# Altium project Universal_Analog_Input.PrjPcb (part 1 of 2)
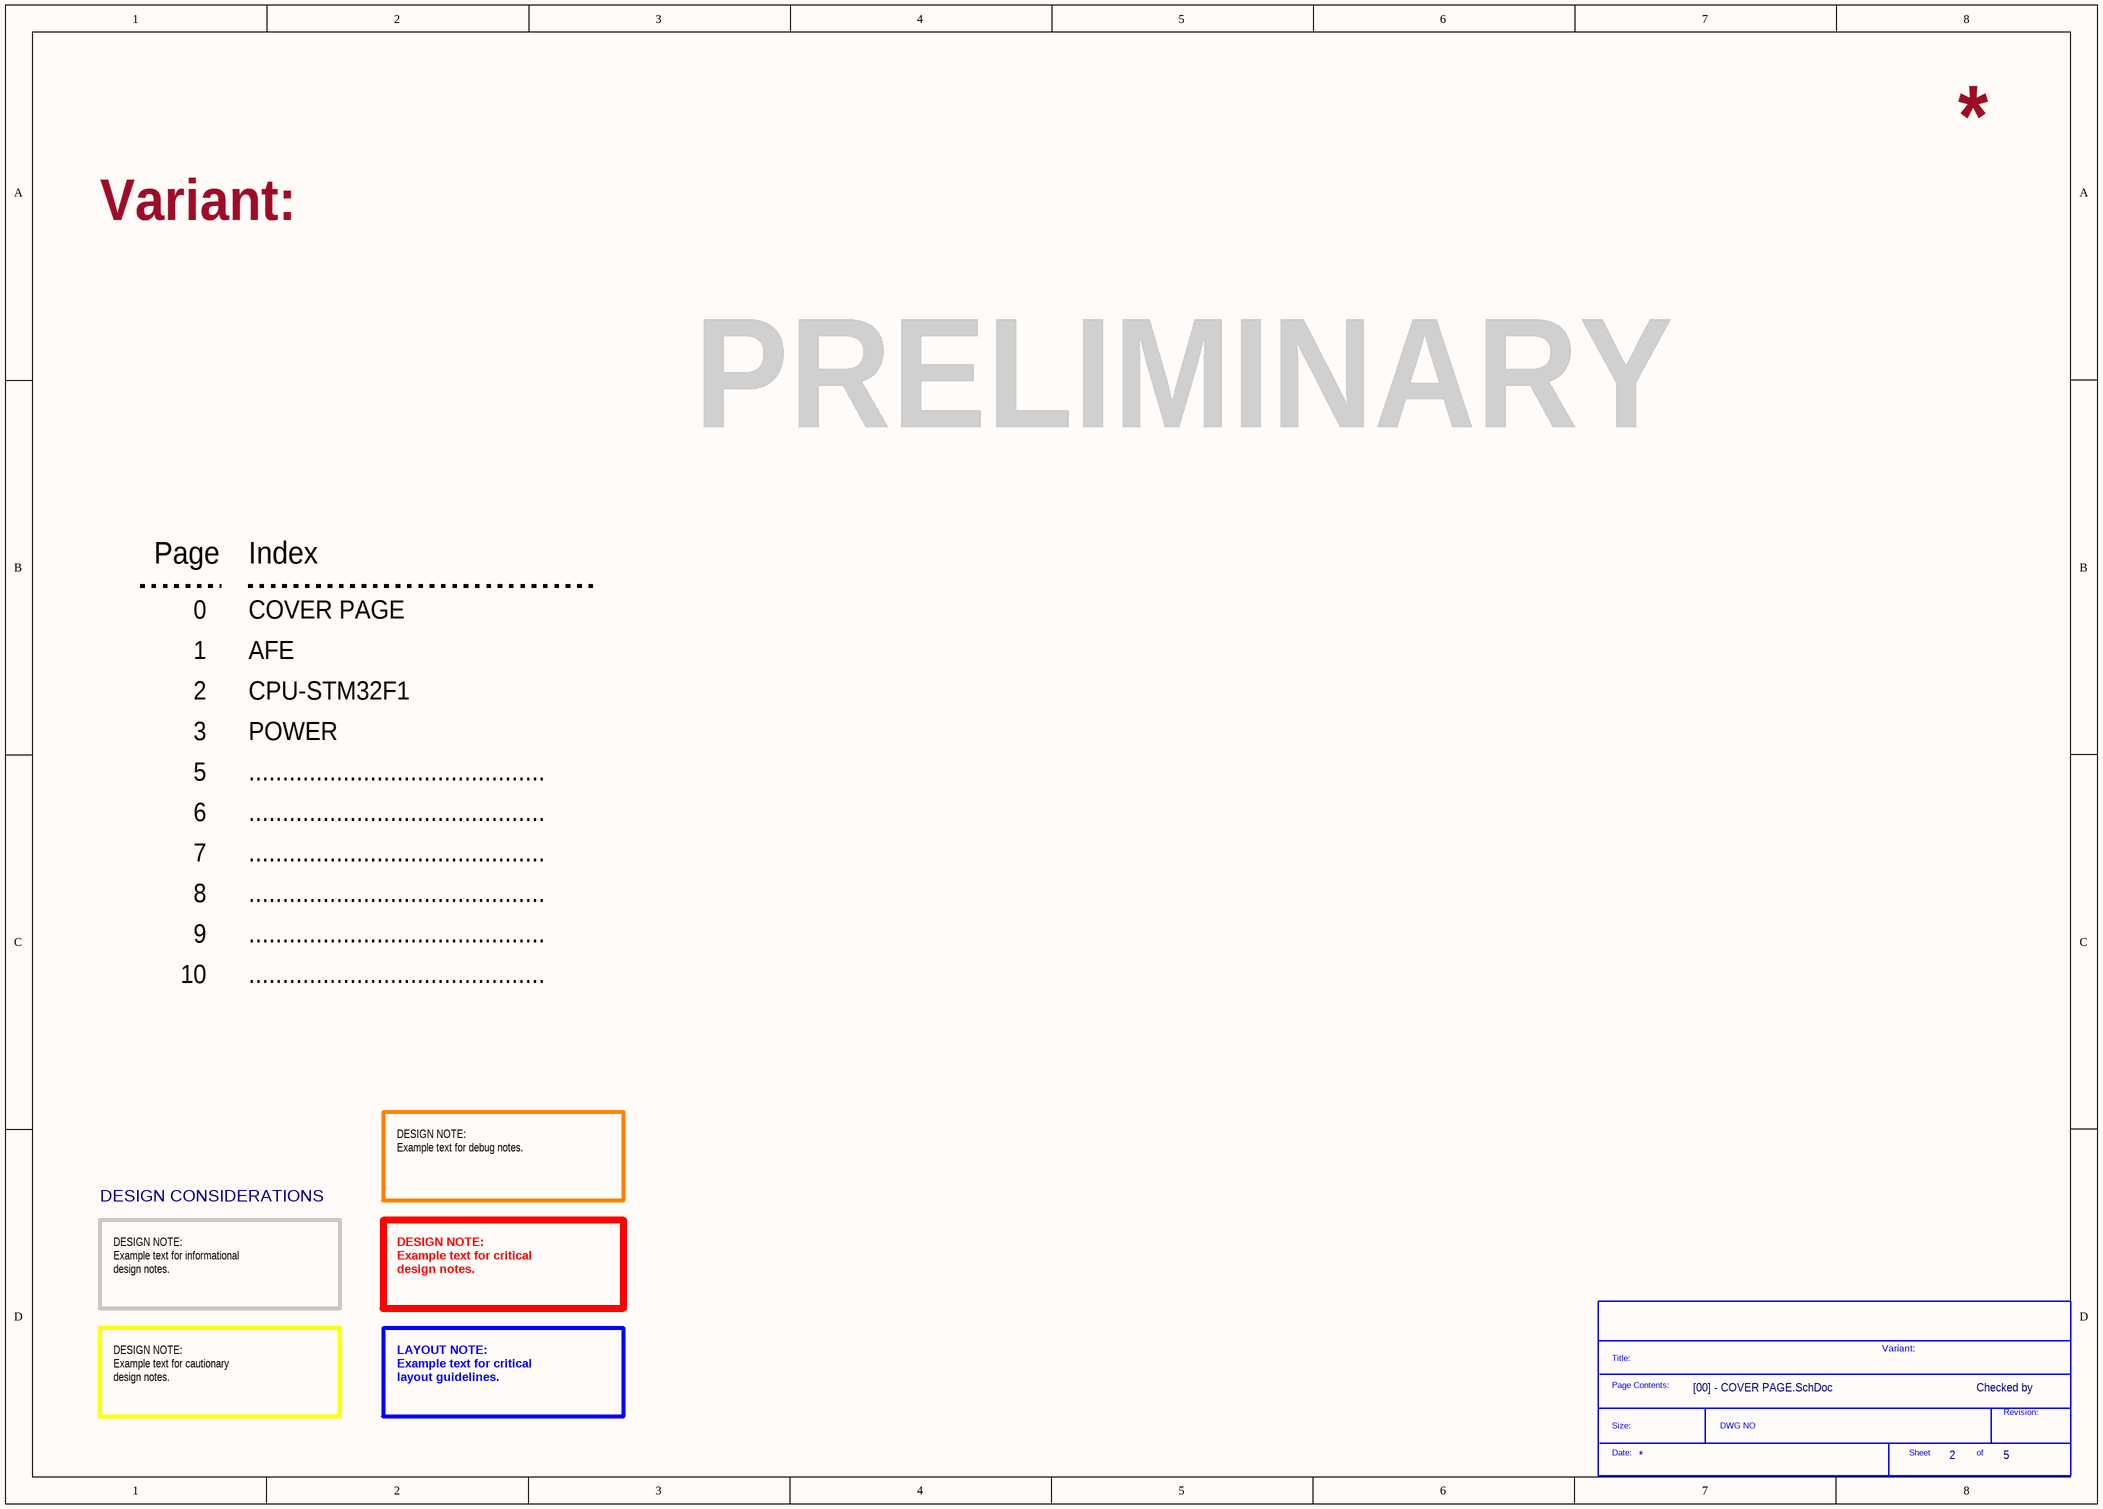
[diagram p0: [00] - COVER PAGE.SchDoc]
4 sheets, 131 parts. Net scope: flat (ports and power ports of the same name join across sheets).
Board file: UAI.PcbDoc
Sheets:
  [00] - COVER PAGE.SchDoc
  [01] - AFE.SchDoc
  [02] - STM32F1.SchDoc
  [03] - Power.SchDoc

## Sheet [00] - COVER PAGE.SchDoc
size A3; DocumentNumber: 2; SheetNumber: 2; SheetTotal: 5

### Parts
*  SDTitleBlock  (value not drawn)  (graphical)

### Notes on the sheet
- Variant:
- PRELIMINARY
- Page
- Index
- 0
- COVER PAGE
- 1
- 2
- AFE
- CPU-STM32F1
- 3
- 5
- POWER
- ............................................
- 6
- 7
- 8
- 9
- 10
- DESIGN NOTE:
  Example text for debug notes.
- DESIGN CONSIDERATIONS
- DESIGN NOTE:
  Example text for informational
  design notes.
- DESIGN NOTE:
  Example text for critical
  design notes.
- Checked by
- DESIGN NOTE:
  Example text for cautionary
  design notes.
- LAYOUT NOTE:
  Example text for critical
  layout guidelines.
- (in symbol SDTitleBlock) Title:; Page Contents:; Revision:; Size:; DWG NO; Date:; Sheet; of

## Sheet [01] - AFE.SchDoc: Universal Analog Input
size A1; CompanyName: Envest Enerji ve Su Verimliliği LTD ŞTİ; DocumentNumber: 3; SheetNumber: 3; SheetTotal: 5
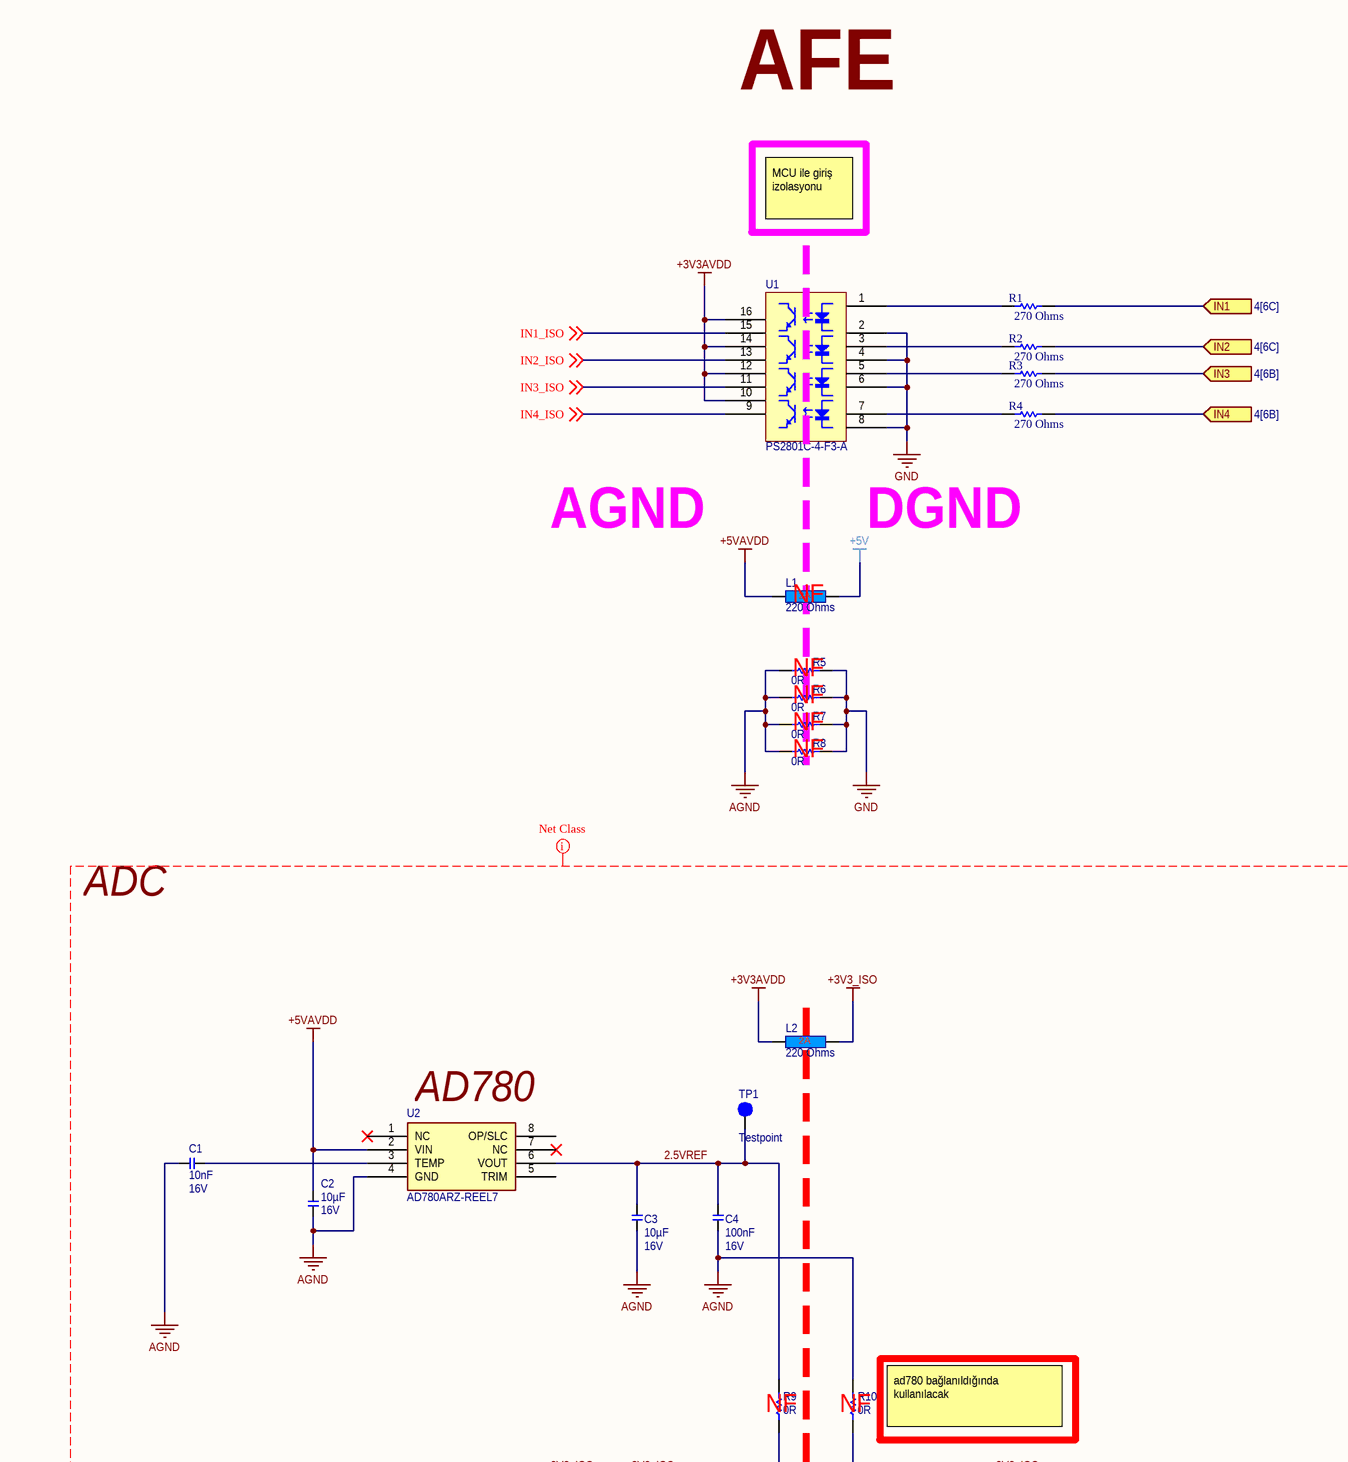
[diagram p1: [01] - AFE.SchDoc, top middle]
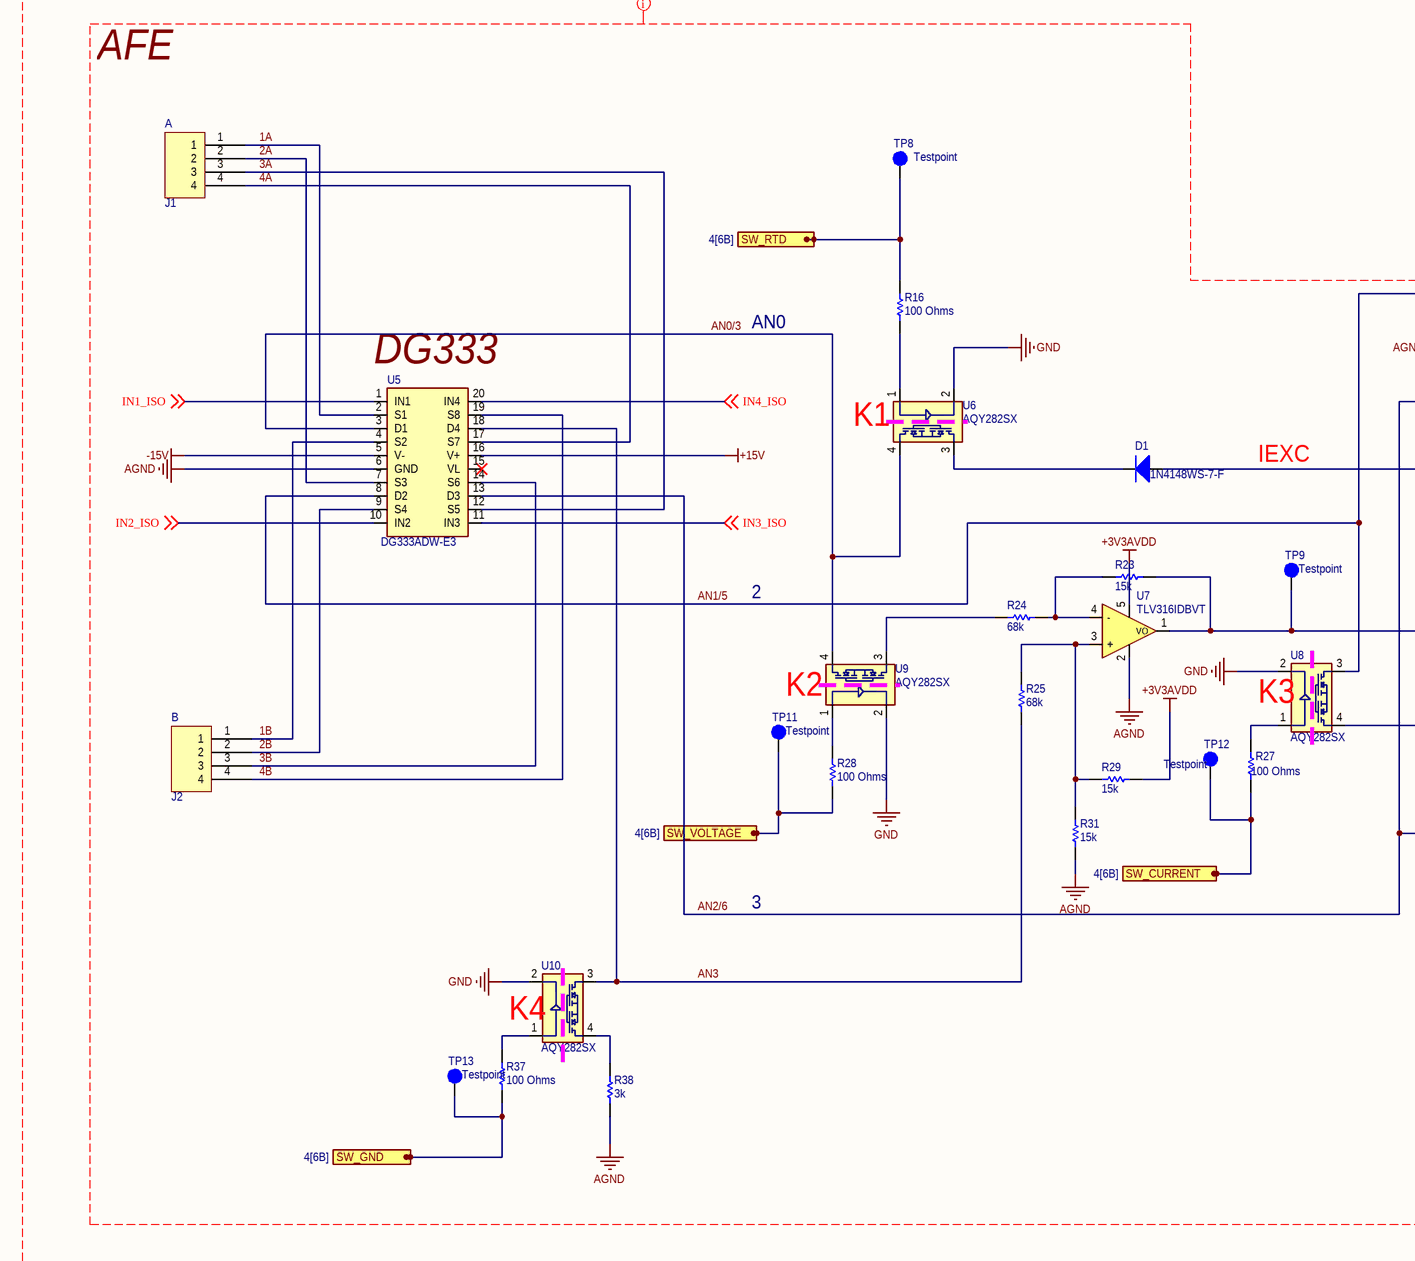
[diagram p2: [01] - AFE.SchDoc, bottom left]
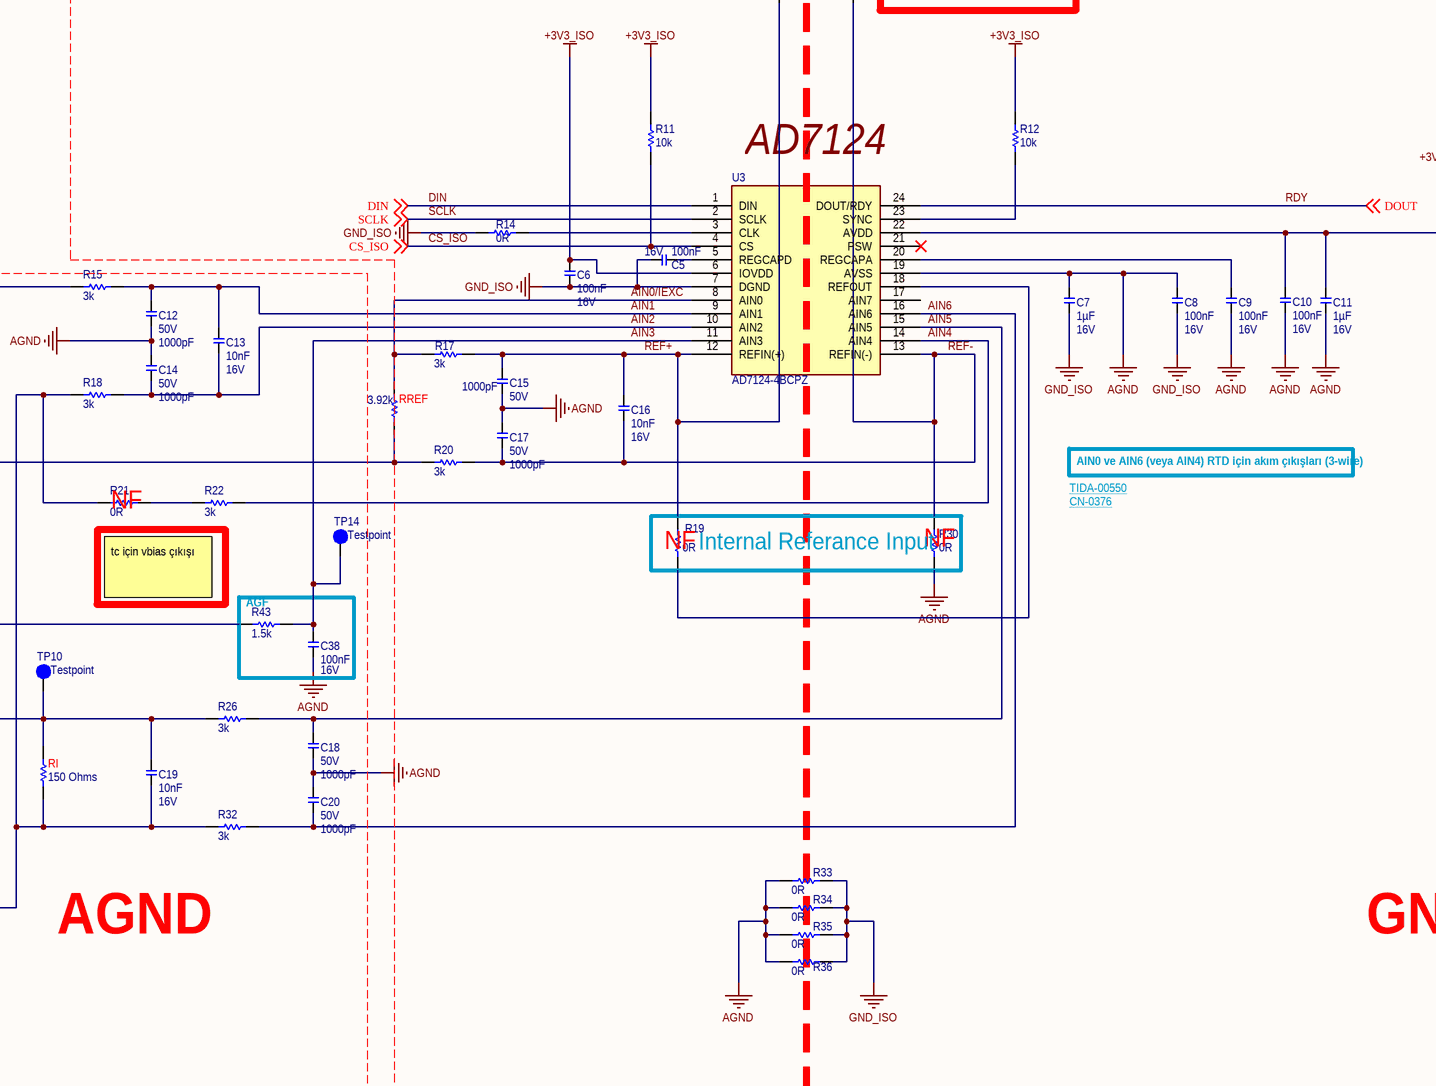
[diagram p3: [01] - AFE.SchDoc, bottom middle]
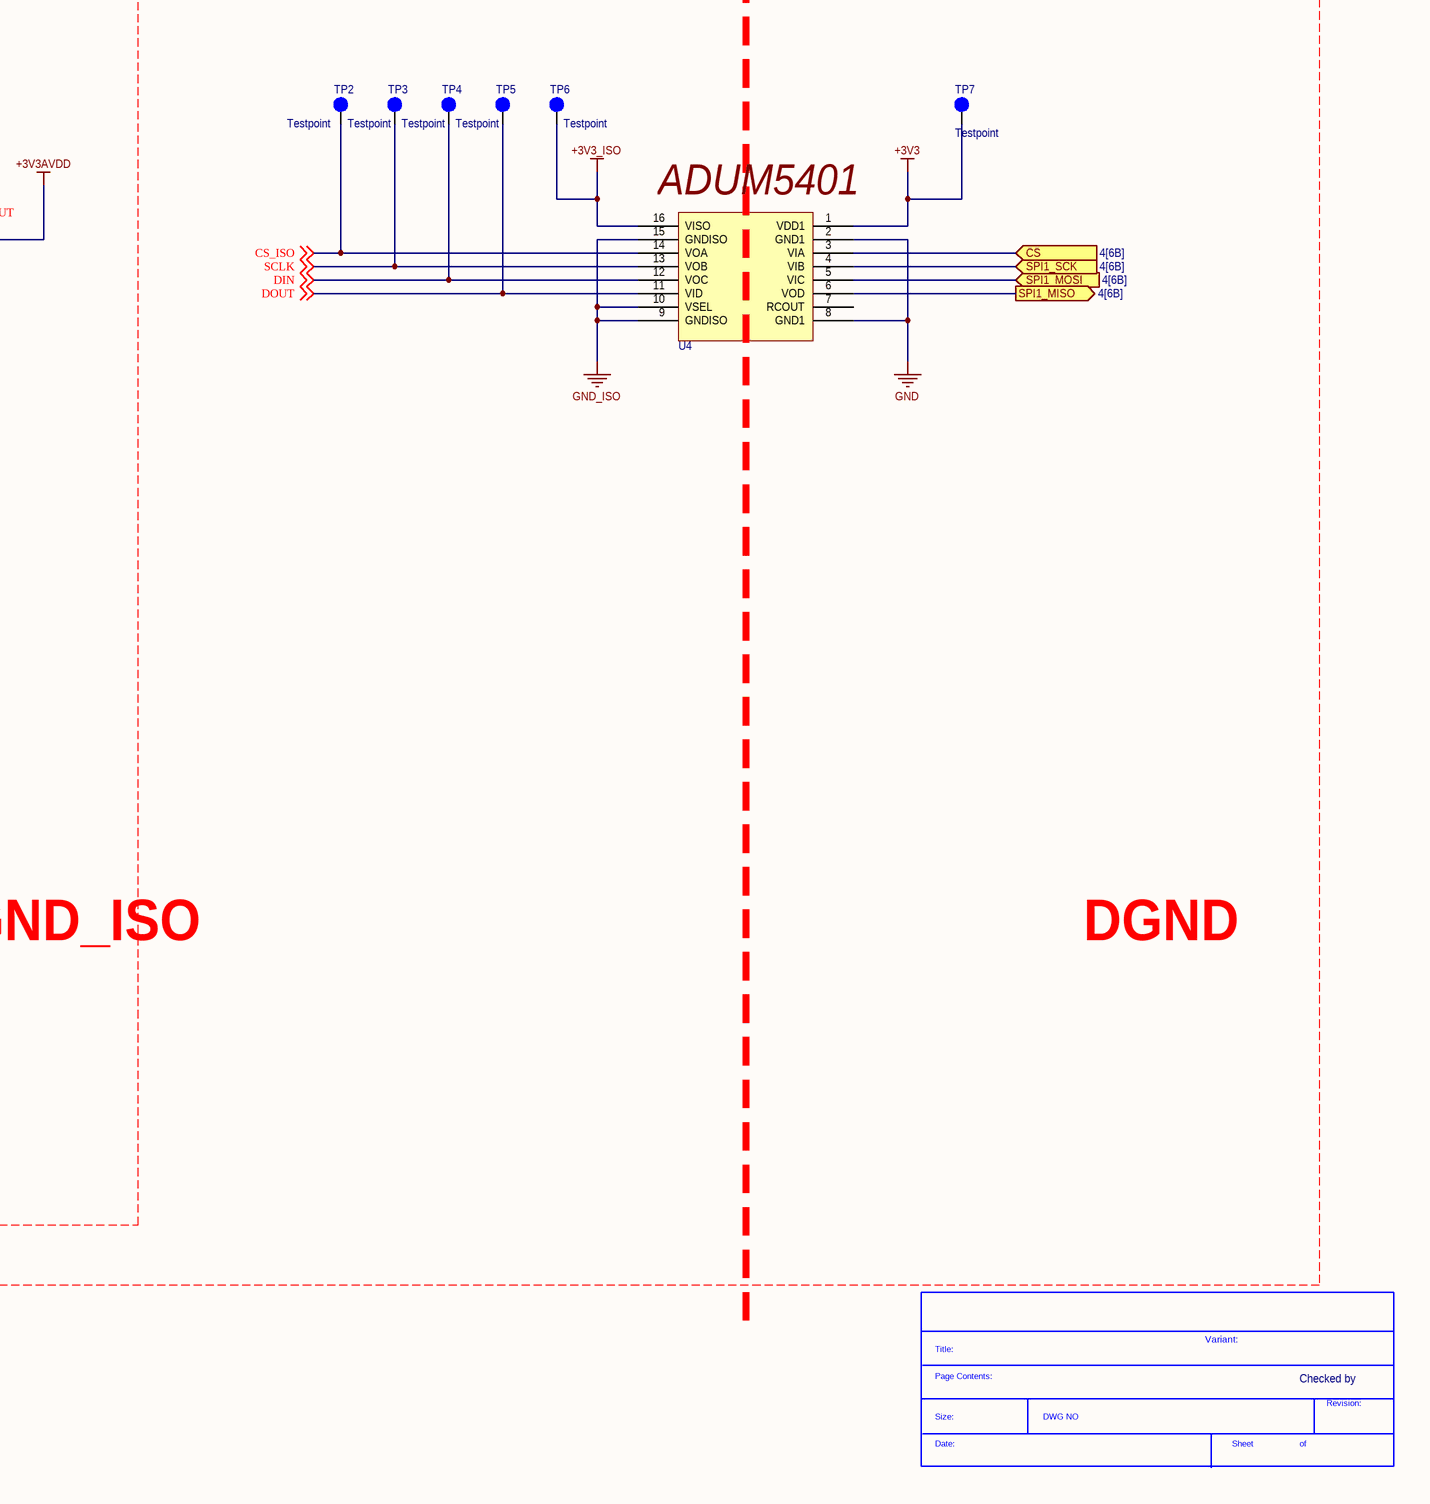
[diagram p4: [01] - AFE.SchDoc, bottom right]

### Parts
(Parts that share a designator on the sheet are numbered #1, #2 ... from top to bottom, then left to right.)
*?#1  SDTitleBlock  (value not drawn)  (graphical)
C1  Voltage - Rated: 16V  [C0805]  (hidden comment: 10nF)
C2  Voltage - Rated: 16V  [C0805]  (hidden comment: 10µF)
C3  Voltage - Rated: 16V  [C0805]  (hidden comment: 10µF)
C4  Voltage - Rated: 16V  [C0805]  (hidden comment: 100nF)
C5  Voltage - Rated: 16V  [C0805]  (hidden comment: 100nF)
C6  Voltage - Rated: 16V  [C0805]  (hidden comment: 100nF)
C7  Voltage - Rated: 16V  [C0805]  (hidden comment: 1µF)
C8  Voltage - Rated: 16V  [C0805]  (hidden comment: 100nF)
C9  Voltage - Rated: 16V  [C0805]  (hidden comment: 100nF)
C10  Voltage - Rated: 16V  [C0805]  (hidden comment: 100nF)
C11  Voltage - Rated: 16V  [C0805]  (hidden comment: 1µF)
C12  Voltage - Rated: 50V  Capacitance: 1000pF  [C0805]  (hidden comment: C0805C102K5RAC7411)
C13  Voltage - Rated: 16V  [C0805]  (hidden comment: 10nF)
C14  Voltage - Rated: 50V  Capacitance: 1000pF  [C0805]  (hidden comment: C0805C102K5RAC7411)
C15  Voltage - Rated: 50V  Capacitance: 1000pF  [C0805]  (hidden comment: C0805C102K5RAC7411)
C16  Voltage - Rated: 16V  [C0805]  (hidden comment: 10nF)
C17  Voltage - Rated: 50V  Capacitance: 1000pF  [C0805]  (hidden comment: C0805C102K5RAC7411)
C18  Voltage - Rated: 50V  Capacitance: 1000pF  [C0805]  (hidden comment: C0805C102K5RAC7411)
C19  Voltage - Rated: 16V  [C0805]  (hidden comment: 10nF)
C20  Voltage - Rated: 50V  Capacitance: 1000pF  [C0805]  (hidden comment: C0805C102K5RAC7411)
C38  Voltage - Rated: 16V  [C0805]  (hidden comment: 100nF)
D1  Manufacturer Part Number: 1N4148WS-7-F  [SOD-323]  (hidden comment: D-1N4148WS)
J1  CON-4 PIN  [CONECTOR_PCB_4_90]  (value not drawn)
J2  CON-4 PIN  [CONECTOR_PCB_4_90]  (value not drawn)
L1  Impedance: 220 Ohms  [0805]  (hidden comment: FERRITE CHIP 220 OHM 0805)
L2  Impedance: 220 Ohms  [0805]  (hidden comment: FERRITE CHIP 220 OHM 0805)
R1  Resistance: 270 Ohms  [R0805]  (hidden comment: 270R)
R2  Resistance: 270 Ohms  [R0805]  (hidden comment: 270R)
R3  Resistance: 270 Ohms  [R0805]  (hidden comment: 270R)
R4  Resistance: 270 Ohms  [R0805]  (hidden comment: 270R)
R5  0R  [R0805]
R6  0R  [R0805]
R7  0R  [R0805]
R8  0R  [R0805]
R9  0R  [R0805]
R10  0R  [R0805]
R11  Resistance (Ohms): 10k  [R0805]  (hidden comment: R-10K,%1,0805)
R12  Resistance (Ohms): 10k  [R0805]  (hidden comment: R-10K,%1,0805)
R14  0R  [R0805]
R15  Resistance (Ohms): 3k  [R0805]  (hidden comment: CPF-A-0805B3K0E)
R16  100 Ohms  [R0805]
R17  Resistance (Ohms): 3k  [R0805]  (hidden comment: CPF-A-0805B3K0E)
R18  Resistance (Ohms): 3k  [R0805]  (hidden comment: CPF-A-0805B3K0E)
R19  0R  [R0805]
R20  Resistance (Ohms): 3k  [R0805]  (hidden comment: CPF-A-0805B3K0E)
R21  0R  [R0805]
R22  Resistance (Ohms): 3k  [R0805]  (hidden comment: CPF-A-0805B3K0E)
R23  Resistance (Ohms): 15k  [R0805]  (hidden comment: 15K OHM)
R24  Resistance (Ohms): 68k  [R0805]  (hidden comment: RES SMD 68K OHM)
R25  Resistance (Ohms): 68k  [R0805]  (hidden comment: RES SMD 68K OHM)
R26  Resistance (Ohms): 3k  [R0805]  (hidden comment: CPF-A-0805B3K0E)
R27  100 Ohms  [R0805]
R28  100 Ohms  [R0805]
R29  Resistance (Ohms): 15k  [R0805]  (hidden comment: 15K OHM)
R30  0R  [R0805]
R31  Resistance (Ohms): 15k  [R0805]  (hidden comment: 15K OHM)
R32  Resistance (Ohms): 3k  [R0805]  (hidden comment: CPF-A-0805B3K0E)
R33  0R  [R0805]
R34  0R  [R0805]
R35  0R  [R0805]
R36  0R  [R0805]
R37  100 Ohms  [R0805]
R38  Resistance (Ohms): 3k  [R0805]  (hidden comment: CPF-A-0805B3K0E)
R43  1.5k  [R0805]
RI  150 Ohms  [R0805]
RREF  Resistance (Ohms): 3.92k  [R0805]  (hidden comment: RN73C2A3K92BTD)
TP1  Testpoint  [tp_smd1mmcircle]  (no BOM)
TP2  Testpoint  [tp_smd1mmcircle]  (no BOM)
TP3  Testpoint  [tp_smd1mmcircle]  (no BOM)
TP4  Testpoint  [tp_smd1mmcircle]  (no BOM)
TP5  Testpoint  [tp_smd1mmcircle]  (no BOM)
TP6  Testpoint  [tp_smd1mmcircle]  (no BOM)
TP7  Testpoint  [tp_smd1mmcircle]  (no BOM)
TP8  Testpoint  [tp_smd1mmcircle]  (no BOM)
TP9  Testpoint  [tp_smd1mmcircle]  (no BOM)
TP10  Testpoint  [tp_smd1mmcircle]  (no BOM)
TP11  Testpoint  [tp_smd1mmcircle]  (no BOM)
TP12  Testpoint  [tp_smd1mmcircle]  (no BOM)
TP13  Testpoint  [tp_smd1mmcircle]  (no BOM)
TP14  Testpoint  [tp_smd1mmcircle]  (no BOM)
U1  PS2801C-4-F3-A  [U_16_D LONG]
U2  Manufacturer Part Number: AD780ARZ-REEL7  [SOIC-8]  (hidden comment: AD780ARZ)
U3  AD7124-4BCPZ  [TSSOP-24]
U4  ADUM5401ARWZ-RL  [DW16_L]  (value not drawn)
U5  Manufacturer Part Number: DG333ADW-E3  [SOIC-20W]  (hidden comment: Analog Switch)
U6  AQY282SX  [CPC1017N]
U7  TLV316IDBVT  [SOT23-5]
U8  AQY282SX  [CPC1017N]
U9  AQY282SX  [CPC1017N]
U10  AQY282SX  [CPC1017N]

### Blocks framed on the sheet
AGF: C38 R43

### Ports
CS (in, see 4[6B]), IN1 (in, see 4[6C]), IN2 (in, see 4[6C]), IN3 (in, see 4[6B]), IN4 (in, see 4[6B]), SPI1_MISO (out, see 4[6B]), SPI1_MOSI (in, see 4[6B]), SPI1_SCK (in, see 4[6B]), SW_CURRENT (in, see 4[6B]), SW_GND (in, see 4[6B]), SW_RTD (in, see 4[6B]), SW_VOLTAGE (in, see 4[6B])

### Nets
+3V3: TP7.1 U4.1(VDD1)
+3V3_ISO: C6.2 L2.2 R11.2 R12.2 TP6.1 U3.6(IOVDD) U4.16(VISO)
+3V3AVDD: C10.2 C11.2 L2.1 R29.2 U1.10 U1.12 U1.14 U1.16 U3.22(AVDD) U7.5(VDD)
+5V: L1.2
+5VAVDD: C2.2 L1.1 U2.2(VIN)
+15V: U5.16(V+)
-15V: U5.5(V-)
AGND: C1.1 C2.1 C3.1 C4.2 C7.2 C8.2 C9.1 C10.1 C11.1 C12.1 C14.2 C15.1 C17.2 C18.1 C20.2 C38.1 R5.1 R6.1 R7.1 R8.1 R10.2 R30.1 R31.1 R33.1 R34.1 R35.1 R36.1 R38.1 U2.4(GND) U3.19(AVSS) U5.6(GND) U7.2(VSS)
GND: R5.2 R6.2 R7.2 R8.2 U1.2 U1.4 U1.6 U1.8 U4.2(GND1) U4.8(GND1) U6.2 U8.2 U9.2 U10.2
GND_ISO: C5.2 C6.1 C7.1 C8.1 R14.1 R33.2 R34.2 R35.2 R36.2 U3.7(DGND) U4.9(GNDISO) U4.10(VSEL) U4.15(GNDISO)
1A: J1.1 U5.2(S1)
1B: J2.1 U5.4(S2)
2.5VREF: C3.2 C4.1 R9.2 TP1.1 U2.6(VOUT)
2A: J1.2 U5.7(S3)
2B: J2.2 U5.9(S4)
3A: J1.3 U5.12(S5)
3B: J2.3 U5.14(S6)
4A: J1.4 U5.17(S7)
4B: J2.4 U5.19(S8)
AIN0/IEXC: R17.1 RREF.2 U3.8(AIN0)
AIN1: C12.2 C13.2 R15.2 U3.9(AIN1)
AIN2: C13.1 C14.1 R18.2 U3.10(AIN2)
AIN3: C38.2 R43.2 TP14.1 U3.11(AIN3)
AIN4: R22.2 U3.14(AIN4)
AIN5: C18.2 R26.2 U3.15(AIN5)
AIN6: C20.1 R32.2 U3.16(AIN6)
AN0/3: U5.3(D1) U6.4 U9.4
AN1/5: R15.1 U5.8(D2) U8.3
AN2/6: C19.1 R18.1 R21.1 R32.1 RI.2 U5.13(D3)
AN3: R25.1 U5.18(D4) U10.3
CS_ISO: R11.1 TP2.1 U3.4(CS) U4.14(VOA) ; off-sheet CS_ISO
DIN: TP4.1 U3.1(DIN) U4.12(VOC) ; off-sheet DIN
IEXC: D1.2 R20.1 RREF.1
IN1_ISO: U1.15 U5.1(IN1) ; off-sheet IN1_ISO
IN2_ISO: U1.13 U5.10(IN2) ; off-sheet IN2_ISO
IN3_ISO: U1.11 U5.11(IN3) ; off-sheet IN3_ISO
IN4_ISO: U1.9 U5.20(IN4) ; off-sheet IN4_ISO
RDY: TP5.1 U3.24(DOUT/RDY) U4.11(VID) ; off-sheet DOUT  [also labelled DOUT]
REF+: C15.2 C16.2 R9.1 R17.2 R19.2 U3.12(REFIN(+))
REF-: C16.1 C17.1 R10.1 R20.2 R30.2 U3.13(REFIN(-))
SCLK: TP3.1 U3.2(SCLK) U4.13(VOB) ; off-sheet SCLK
SPI1_MISO: U4.6(VOD) ; port SPI1_MISO
SPI1_MOSI: U4.5(VIC) ; port SPI1_MOSI
SPI1_SCK: U4.4(VIB) ; port SPI1_SCK
NetC1_2: C1.2 U2.3(TEMP)
NetC5_1: C5.1 U3.5(REGCAPD)
NetC9_2: C9.2 U3.20(REGCAPA)
NetC19_2: C19.2 R26.1 RI.1 TP10.1 U8.4
NetD1_1: D1.1 U6.3
NetR1_1: R1.1 U1.1
NetR1_2: R1.2 ; port IN1
NetR2_1: R2.1 U1.3
NetR2_2: R2.2 ; port IN2
NetR3_1: R3.1 U1.5
NetR3_2: R3.2 ; port IN3
NetR4_1: R4.1 U1.7
NetR4_2: R4.2 ; port IN4
NetR12_1: R12.1 U3.23(SYNC)
NetR14_2: R14.2 U3.3(CLK)
NetR16_1: R16.1 TP8.1 ; port SW_RTD
NetR16_2: R16.2 U6.1
NetR19_1: R19.1 U3.18(REFOUT)
NetR21_2: R21.2 R22.1
NetR23_1: R23.1 R24.2 U7.4(-)
NetR23_2: R23.2 R43.1 TP9.1 U7.1(VO)
NetR24_1: R24.1 U9.3
NetR25_2: R25.2 R29.1 R31.2 U7.3(+)
NetR27_1: R27.1 TP12.1 ; port SW_CURRENT
NetR27_2: R27.2 U8.1
NetR28_1: R28.1 TP11.1 ; port SW_VOLTAGE
NetR28_2: R28.2 U9.1
NetR37_1: R37.1 TP13.1 ; port SW_GND
NetR37_2: R37.2 U10.1
NetR38_2: R38.2 U10.4
NetU4_3: U4.3(VIA) ; port CS

Not connected (* = marked no-connect by the designer): U2 1(NC)* 5(TRIM) 7(NC)* 8(OP/SLC); U3 17(AIN7) 21(PSW)*; U4 7(RCOUT); U5 15(VL)*

### Layout directives
net class ADC: 2.5VREF, +3V3_ISO, +3V3AVDD, +5VAVDD, AGND, AIN0/IEXC, AIN1, AIN2, AIN3, AIN4, AIN5, AIN6, CS_ISO, DIN, DOUT, GND_ISO, RDY, REF+, REF-, SCLK
net class AFE: 1A, 1B, 2A, 2B, 3A, 3B, 4A, 4B, +3V3AVDD, +15V, -15V, AGND, AN0/3, AN1/5, AN2/6, AN3, GND, IEXC, IN1_ISO, IN2_ISO, IN3_ISO, IN4_ISO
net class ANALOG: 1A, 1B, 2.5VREF, 2A, 2B, 3A, 3B, 4A, 4B, +3V3, +3V3_ISO, +3V3AVDD, +5V, +5VAVDD, +15V, -15V, AGND, AIN0/IEXC, AIN1, AIN2, AIN3, AIN4, AIN5, AIN6, AN0/3, AN1/5, AN2/6, AN3, CS_ISO, DIN, DOUT, GND, GND_ISO, IEXC, IN1_ISO, IN2_ISO, IN3_ISO, IN4_ISO, RDY, REF+, REF-, SCLK

### Notes on the sheet
- AFE
- MCU ile giriş izolasyonu
- AGND
- DGND
- (near L1) NF
- (near R5) NF
- (near R6) NF
- (near R7) NF
- (near R8) NF
- ADC
- (near U2) AD780
- (near R9) NF
- (near R10) NF
- (near R10) ad780 bağlanıldığında kullanılacak
- (near J1) A
- (near U3) AD7124
- (near U4) ADUM5401
- (near U5) DG333
- AN0
- (near U6) K1
- (near R21) NF
- CN-0376 <http://www.analog.com/media/en/reference-design-documentation/reference-designs/CN0376.pdf>
- TIDA-00550 <http://www.ti.com/lit/ug/tidubi1/tidubi1.pdf>
- AIN0 ve AIN6 (veya AIN4) RTD için akım çıkışları (3-wire)
- (near R19) NF
- (near R30) Internal Referance Input
- (near R30) NF
- 2
- tc için vbias çıkışı
- (near J2) B
- (near U9) K2
- (near U8) K3
- 3
- GND_ISO
- (near U10) K4
- Variant:
- Checked by
- (in symbol L-220 Ohm,2A) 2A
- (in symbol SDTitleBlock) Title:; Page Contents:; Revision:; Size:; DWG NO; Date:; Sheet; of

### Library data of the parts
C1 = C-10NF,0805: CAP CER 10000PF 16V NP0 0805; Manufacturer: AVX Corporation; Manufacturer Part Number: 0805YA103JAT2A; Tolerance: ±5%; Temperature Coefficient: C0G, NP0; Supplier 1: Digi-Key; RoHS: RoHS Compliant; Category: Capacitors; Stock 1: 28062; Pricing 1: 1=0.29, 10=0.204, 25=0.1668, 50=0.1424, 100=0.1221, 250=0.10176, 500=0.09158, 1000=0.07733 (USD); Packaging: Cut Tape (CT); Mounting Type: Surface Mount, MLCC; Operating Temperature: -55°C ~ 125°C; Applications: General Purpose; Ratings: -; Package / Case: 0805 (2012 Metric); Size / Dimension: 0.079" L x 0.049" W (2.01mm x 1.25mm); Height - Seated (Max): -; Thickness (Max): 0.037" (0.94mm); Lead Spacing: -; Features: -; Lead Style: -; ComponentLink1URL: http://datasheets.avx.com/C0GNP0-Dielectric.pdf; ComponentLink1Description: http://datasheets.avx.com/C0GNP0-Dielectric.pdf; Supplier Part Number 1: 478-1334-1-ND; Capacitance: 10nF
C2 C3 = C-10UF,16V,0805: AVX - 0805YD106KAT2A - CAP, MLCC, X5R, 10UF, 16V, 0805; Manufacturer: AVX Corporation; Tolerance: ±10%; Supplier 1: Digi-Key; Manufacturer Part Number: 0805YD106KAT2A; RoHS: RoHS Compliant; Category: Capacitors; Stock 1: 293738; Pricing 1: 1=0.18, 10=0.124, 25=0.0908, 50=0.0742, 100=0.0627, 250=0.05116, 500=0.0429, 1000=0.03795 (USD); Packaging: Digi-Reel®; Temperature Coefficient: X5R; Mounting Type: Surface Mount, MLCC; Operating Temperature: -55°C ~ 85°C; Applications: General Purpose; Ratings: -; Package / Case: 0805 (2012 Metric); Size / Dimension: 0.079" L x 0.049" W (2.01mm x 1.25mm); Height - Seated (Max): -; Thickness (Max): 0.055" (1.40mm); Lead Spacing: -; Features: -; Lead Style: -; ComponentLink1URL: http://datasheets.avx.com/cx5r.pdf; ComponentLink1Description: http://datasheets.avx.com/cx5r.pdf; Supplier Part Number 1: 478-5165-6-ND; Capacitance: 10µF
C4-C6 C8-C10 C38 = C-100NF,16V,0805: AVX - 0805YA103JAT2A - CAP, MLCC, C0G/NP0, 10NF, 16V, 0805; Tolerance: ±5%; Temperature Coefficient: C0G, NP0; Manufacturer: AVX; Manufacturer Part Number: 0805YA103JAT2A; RoHS: YES; ComponentLink1URL: http://www.avx.com/docs/Catalogs/ccog.pdf; ComponentLink1Description: http://www.avx.com/docs/Catalogs/ccog.pdf; ComponentLink2URL: http://www.farnell.com/datasheets/1825494.pdf; ComponentLink2Description: http://www.farnell.com/datasheets/1825494.pdf; Supplier 1: Digi-Key; Category: Capacitors; Stock 1: 28062; Pricing 1: 1=0.29, 10=0.204, 25=0.1668, 50=0.1424, 100=0.1221, 250=0.10176, 500=0.09158, 1000=0.07733 (USD); Packaging: Cut Tape (CT); Mounting Type: Surface Mount, MLCC; Operating Temperature: -55°C ~ 125°C; Applications: General Purpose; Ratings: -; Package / Case: 0805 (2012 Metric); Size / Dimension: 0.079" L x 0.049" W (2.01mm x 1.25mm); Height - Seated (Max): -; Thickness (Max): 0.037" (0.94mm); Lead Spacing: -; Features: -; Lead Style: -; ComponentLink3URL: http://datasheets.avx.com/C0GNP0-Dielectric.pdf; ComponentLink3Description: http://datasheets.avx.com/C0GNP0-Dielectric.pdf; Supplier Part Number 1: 478-1334-1-ND; Capacitance: 100nF
C7 C11 = C-1UF,16V,0805: AVX - 0805YC105KAT2A - CAP, MLCC, X7R, 1UF, 16V, 0805; Manufacturer: AVX Corporation; Tolerance: ±10%; Supplier 1: Digi-Key; Manufacturer Part Number: 0805YC105KAT2A; RoHS: RoHS Compliant; Category: Capacitors; Stock 1: 76930; Pricing 1: 1=0.19, 10=0.132, 25=0.0964, 50=0.075, 100=0.0622, 250=0.05148, 500=0.04362, 1000=0.03611 (USD); Packaging: Cut Tape (CT); Temperature Coefficient: X7R; Mounting Type: Surface Mount, MLCC; Operating Temperature: -55°C ~ 125°C; Applications: General Purpose; Ratings: -; Package / Case: 0805 (2012 Metric); Size / Dimension: 0.079" L x 0.049" W (2.01mm x 1.25mm); Height - Seated (Max): -; Thickness (Max): 0.055" (1.40mm); Lead Spacing: -; Features: -; Lead Style: -; ComponentLink1URL: http://datasheets.avx.com/X7RDielectric.pdf; ComponentLink1Description: http://datasheets.avx.com/X7RDielectric.pdf; Supplier Part Number 1: 478-5034-1-ND; Capacitance: 1µF
C12 C14 C15 C17 C18 C20 = C-1nF,50V,0805: CAP CER 1000PF 50V X7R 0805; Manufacturer: Kemet; Tolerance: ±10%; Supplier 1: Digi-Key; Manufacturer Part Number: C0805C102K5RAC7411; RoHS: RoHS Compliant; Category: Capacitors; Stock 1: 60000; Pricing 1: 15000=0.0062, 30000=0.00589, 75000=0.00527, 105000=0.00426 (USD); Packaging: Tape & Reel (TR); Temperature Coefficient: X7R; Mounting Type: Surface Mount, MLCC; Operating Temperature: -55°C ~ 125°C; Applications: General Purpose; Ratings: -; Package / Case: 0805 (2012 Metric); Size / Dimension: 0.079" L x 0.049" W (2.00mm x 1.25mm); Height - Seated (Max): -; Thickness (Max): 0.035" (0.88mm); Lead Spacing: -; Features: Low ESL; Lead Style: -; ComponentLink1URL: http://www.kemet.com/docfinder?Partnumber=C0805C102K5RAC7411; ComponentLink1Description: http://www.kemet.com/docfinder?Partnumber=C0805C102K5RAC7411; Supplier Part Number 1: 399-7361-2-ND
C13 C16 C19 = C-10NF,16V,0805: CAP CER 10000PF 16V NP0 0805; Manufacturer: AVX Corporation; Manufacturer Part Number: 0805YA103JAT2A; Tolerance: ±5%; Temperature Coefficient: C0G, NP0; Supplier 1: Digi-Key; RoHS: RoHS Compliant; Category: Capacitors; Stock 1: 28062; Pricing 1: 1=0.29, 10=0.204, 25=0.1668, 50=0.1424, 100=0.1221, 250=0.10176, 500=0.09158, 1000=0.07733 (USD); Packaging: Cut Tape (CT); Mounting Type: Surface Mount, MLCC; Operating Temperature: -55°C ~ 125°C; Applications: General Purpose; Ratings: -; Package / Case: 0805 (2012 Metric); Size / Dimension: 0.079" L x 0.049" W (2.01mm x 1.25mm); Height - Seated (Max): -; Thickness (Max): 0.037" (0.94mm); Lead Spacing: -; Features: -; Lead Style: -; ComponentLink1URL: http://datasheets.avx.com/C0GNP0-Dielectric.pdf; ComponentLink1Description: http://datasheets.avx.com/C0GNP0-Dielectric.pdf; Supplier Part Number 1: 478-1334-1-ND; Capacitance: 10nF
D1 = D-1N4148WS: DIODES INC. - 1N4148WS-7-F - DIODE, SS SWITCH, 75V, 0.2W, SOD323; Diode Configuration: Single; Repetitive Reverse Voltage Vrrm Max: 75; Forward Current If(AV): 150; Forward Voltage VF Max: 1.25; Reverse Recovery Time trr Max: 4; Forward Surge Current Ifsm Max: 2; Product Range: 1N4148 Series; SVHC: No SVHC (17-Dec-2015); Diode Type: Switching; Supplier 1: Farnell; Manufacturer: DIODES INC.; RoHS: YES; Stock 1: 52116; Pricing 1: 1=0.186, 25=0.142, 100=0.0928, 250=0.0514, 500=0.0433, 1000=0.0256, 3000=0.025, 8000=0.0239 (GBP); Operating Temperature Max: 150; Diode Case Style: SOD-323; No. of Pins: 2; Packaging: Cut Tape; MSL: MSL 1 - Unlimited; Operating Temperature Min: -65; Operating Temperature Range: -65°C to +150°C<!--FANDB--><div class="features-and-benefits-container"><div class="features-and-benefits-description"><span class="features-benefits-value">The 1N4148WS-7-F is a surface mount fast Switching Diode with matte tin-plated terminals and an UL94V-0 green molding compound molded plastic case. Solderable terminals as per MIL-STD-202, method 208 standard. Color band denotes cathode end polarity. It is suitable for general purpose switching applications.</span></div><div class="features-and-benefits-list"><ul class="features-and-benefits-list-list"><li class="features-and-benefits-list-item">Fast switching speed</li><li class="features-and-benefits-list-item">100V Non-repetitive peak reverse voltage</li><li class="features-and-benefits-list-item">53V RMS reverse voltage</li><li class="features-and-benefits-list-item">200mW Power dissipation</li><li class="features-and-benefits-list-item">625; ComponentLink1URL: http://www.farnell.com/datasheets/1911818.pdf; ComponentLink1Description: http://www.farnell.com/datasheets/1911818.pdf; Supplier Part Number 1: 1843678
J1 J2 = CON-4 PIN: Terminal Block 4 Pin
L1 L2 = L-220 Ohm,2A: Manufacturer: Murata; Manufacturer Part Number: BLM21PG221SN1D; Tolerance: 25; Resistance: 50; Max Current Rating: 2; Supplier 1: Digikey; Stock 1: 423629; Pricing 1: 1=0.11, 10=0.09, 50=0.0732, 100=0.0537, 250=0.0391, 500=0.0358, 1000=0.0309 (USD); Mount: Surface Mount; Case/Package: 0805; Case Code (Metric): 2012; Case Code (Imperial): 0805; Min Operating Temperature: -55; Max Operating Temperature: 125; Core Material: Ferrite; Package Quantity: 1; Packaging: Tape and Reel; Current Rating: 2; Length: 2; Height: 0.85; Width: 1.25; Radiation Hardening: No; REACH SVHC: No SVHC; Supplier Part Number 1: 490-1054-1-ND
R1-R4 = R-270R,0805: TE CONNECTIVITY / NEOHM 270R Thin Film; Manufacturer Part Number: CPF0805B270RE1; Product Range: TE CONNECTIVITY - CPF Series; Power Rating: 100; Resistance Tolerance: ± 0.1%; Resistor Case Style: 0805 [2012 Metric]; Temperature Coefficient: ± 25; Voltage Rating: 200; External Depth: 0.5; External Length / Height: 2; External Width: 1.25; Resistor Mounting: SMD; Supplier 1: Farnell; Manufacturer: TE CONNECTIVITY / NEOHM; RoHS: YES; Stock 1: 755; Pricing 1: 10=0,43, 50=0,34, 100=0,32, 500=0,27, 1000=0,24 (EUR); Resistor Element Material: Thin Film; Packaging: Cut Tape; MSL: -; No. of Pins: 2; Operating Temperature Max: 155; Operating Temperature Min: -55; Operating Temperature Range: -55°C to +155; Series: CPF<!--FANDB--><div class="features-and-benefits-container"></div>; ComponentLink1URL: http://www.tycoelectronics.com/commerce/DocumentDelivery/DDEController?Action=srchrtrv&DocNm=1614884&DocType=Customer+Drawing&DocLang=English; ComponentLink1Description: http://www.tycoelectronics.com/commerce/DocumentDelivery/DDEController?Action=srchrtrv&DocNm=1614884&DocType=Customer+Drawing&DocLang=English; ComponentLink2URL: http://www.tycoelectronics.com/commerce/DocumentDelivery/DDEController?Action=srchrtrv&DocNm=1773200&DocType=Data+Sheet&DocLang=English; ComponentLink2Description: http://www.tycoelectronics.com/commerce/DocumentDelivery/DDEController?Action=srchrtrv&DocNm=1773200&DocType=Data+Sheet&DocLang=English; Supplier Part Number 1: 1697424
R5-R10 R14 R19 R21 R30 R33-R36 = R-0R,0805: BOURNS - CR0805-J/-000ELF - RESISTOR, 0805, 0R, 5%, 1/8W; Product Range: BOURNS - CR Series; Power Rating: 125; Resistor Case Style: 0805 [2012 Metric]; Resistor Element Material: Thick Film; Temperature Coefficient: -250ppm/°C to +500; Voltage Rating: 150; SVHC: No SVHC (16-Jun-2014); Resistor Mounting: SMD<!--FANDB--><div class="features-and-benefits-container"></div>; Supplier 1: Farnell; Manufacturer: BOURNS; Manufacturer Part Number: CR0805-J/-000ELF; RoHS: YES; Stock 1: 20931; Pricing 1: 50=0,0234, 250=0,0208, 1000=0,0182, 5000=0,0143, 10000=0,0104 (EUR); Resistance Tolerance: ± 5%; Packaging: Cut Tape; MSL: MSL 1 - Unlimited; ComponentLink1URL: http://www.farnell.com/datasheets/1845293.pdf; ComponentLink1Description: http://www.farnell.com/datasheets/1845293.pdf; Supplier Part Number 1: 2008388RL; Supplier 2: Farnell; Supplier 3: Newark; Supplier Part Number 3: 66F5622; Resistance: 0R
R11 R12 = R-10K,%1,0805: RES SMD 10K OHM 1% 1/8W 0805; Manufacturer: Yageo; Manufacturer Part Number: RC0805FR-0710KL; Power (Watts): 0.125W, 1/8W; Temperature Coefficient: ±100ppm/°C; Supplier 1: Digi-Key; RoHS: RoHS Compliant; Category: Resistors; Stock 1: 4020575; Pricing 1: 1=0.1, 10=0.021, 25=0.0152, 100=0.0084, 250=0.00644, 500=0.00514, 1000=0.00379, 2500=0.00329 (USD); Packaging: Cut Tape (CT); Tolerance: ±1%; Composition: Thick Film; Features: Moisture Resistant; Operating Temperature: -55°C ~ 155°C; Package / Case: 0805 (2012 Metric); Supplier Device Package: 0805; Size / Dimension: 0.079" L x 0.049" W (2.00mm x 1.25mm); Height: 0.024" (0.60mm); Number of Terminations: 2; ComponentLink1URL: http://www.yageo.com/documents/recent/PYu-RC_Group_51_RoHS_L_04.pdf; ComponentLink1Description: http://www.yageo.com/documents/recent/PYu-RC_Group_51_RoHS_L_04.pdf; Supplier Part Number 1: 311-10.0KCRCT-ND
R15 R17 R18 R20 R22 R26 R32 R38 = R-3K,0805: RES SMD 3K OHM 0.1% 1/10W 0805; Manufacturer: TE Connectivity AMP Connectors; Power (Watts): 0.1W, 1/10W; Temperature Coefficient: ±25ppm/°C; Supplier 1: Digi-Key; Manufacturer Part Number: CPF-A-0805B3K0E; RoHS: RoHS Compliant; Category: Resistors; Stock 1: 5000; Pricing 1: 5000=0.09556, 10000=0.09161, 25000=0.08981, 50000=0.08895, 125000=0.08802 (USD); Packaging: Tape & Reel (TR); Tolerance: ±0.1%; Composition: Thin Film; Features: Automotive AEC-Q200; Operating Temperature: -55°C ~ 155°C; Package / Case: 0805 (2012 Metric); Supplier Device Package: 0805; Size / Dimension: 0.079" L x 0.049" W (2.00mm x 1.25mm); Height: 0.026" (0.65mm); Number of Terminations: 2; ComponentLink1URL: http://www.te.com/commerce/DocumentDelivery/DDEController?Action=srchrtrv&DocNm=1773200-1&DocType=DS&DocLang=English; ComponentLink1Description: http://www.te.com/commerce/DocumentDelivery/DDEController?Action=srchrtrv&DocNm=1773200-1&DocType=DS&DocLang=English; Supplier Part Number 1: A124098TR-ND
R16 R27 R28 R37 = R-100R,0805: RES 100 OHM 1/8W 1% 0805 SMD; Manufacturer: Rohm Semiconductor; Manufacturer Part Number: MCR10ERTF1000; Power (Watts): 0.125W, 1/8W; Temperature Coefficient: ±100ppm/°C; Supplier 1: Digi-Key; RoHS: RoHS Compliant; Category: Resistors; Stock 1: 27803; Pricing 1: 1=0.1, 10=0.027, 25=0.0196, 100=0.0109, 250=0.00832, 500=0.00666, 1000=0.0049 (USD); Packaging: Cut Tape (CT); Tolerance: ±1%; Composition: Thick Film; Features: -; Package / Case: 0805 (2012 Metric); Supplier Device Package: 0805 (2012 Metric); Size / Dimension: 0.079" L x 0.049" W (2.00mm x 1.25mm); Height: 0.024" (0.60mm); Number of Terminations: 2; ComponentLink1URL: http://rohmfs.rohm.com/en/products/databook/datasheet/passive/resistor/chip_resistor/mcr_g.pdf; ComponentLink1Description: http://rohmfs.rohm.com/en/products/databook/datasheet/passive/resistor/chip_resistor/mcr_g.pdf; Supplier Part Number 1: RHM100CHCT-ND; Resistance (Ohms): 100 Ohms
R23 R29 R31 = R-15k,0805: RES SMD 15K OHM 5% 1/8W 0805; Manufacturer: Yageo; Manufacturer Part Number: RC0805JR-0715KL; Power (Watts): 0.125W, 1/8W; Temperature Coefficient: ±100ppm/°C; Supplier 1: Digi-Key; RoHS: RoHS Compliant; Category: Resistors; Stock 1: 97321; Pricing 1: 1=0.1, 10=0.018, 25=0.0128, 100=0.0073, 250=0.00556, 500=0.00444, 1000=0.00326, 2500=0.00283 (USD); Packaging: Cut Tape (CT); Tolerance: ±5%; Composition: Thick Film; Features: Moisture Resistant; Operating Temperature: -55°C ~ 155°C; Package / Case: 0805 (2012 Metric); Supplier Device Package: 0805; Size / Dimension: 0.079" L x 0.049" W (2.00mm x 1.25mm); Height: 0.024" (0.60mm); Number of Terminations: 2; ComponentLink1URL: http://www.yageo.com/documents/recent/PYu-RC_Group_51_RoHS_L_04.pdf; ComponentLink1Description: http://www.yageo.com/documents/recent/PYu-RC_Group_51_RoHS_L_04.pdf; Supplier Part Number 1: 311-15KARCT-ND
R24 R25 = R-68k,0805: RES SMD 68K OHM 1% 1/8W 0805; Manufacturer: Samsung Electro-Mechanics America, Inc.; Manufacturer Part Number: RC2012F683CS; Power (Watts): 0.125W, 1/8W; Temperature Coefficient: ±100ppm/°C; Supplier 1: Digi-Key; RoHS: RoHS Compliant; Category: Resistors; Stock 1: 80000; Pricing 1: 5000=0.00473, 10000=0.00411, 25000=0.00361, 50000=0.00339 (USD); Packaging: Tape & Reel (TR); Part Status: Active; Tolerance: ±1%; Composition: Thick Film; Features: Moisture Resistant; Operating Temperature: -55°C ~ 155°C; Package / Case: 0805 (2012 Metric); Supplier Device Package: 0805; Size / Dimension: 0.079" L x 0.049" W (2.00mm x 1.25mm); Height - Seated (Max): 0.026" (0.65mm); Number of Terminations: 2; Failure Rate: -; ComponentLink1URL: http://media.digikey.com/pdf/Data%20Sheets/Samsung%20PDFs/RC_Series_ds.pdf; ComponentLink1Description: http://media.digikey.com/pdf/Data%20Sheets/Samsung%20PDFs/RC_Series_ds.pdf; Supplier Part Number 1: 1276-5386-2-ND
R43 = R-1.5K,%1,0805: RES SMD 1.5K OHM 1% 1/8W 0805; Manufacturer: Yageo; Manufacturer Part Number: RC0805FR-071K5L; Power (Watts): 0.125W, 1/8W; Temperature Coefficient: ±100ppm/°C; Supplier 1: Digi-Key; RoHS: RoHS Compliant; Category: Resistors; Stock 1: 815764; Pricing 1: 1=0.1, 10=0.021, 25=0.0152, 100=0.0084, 250=0.00644, 500=0.00514, 1000=0.00379, 2500=0.00329 (USD); Packaging: Digi-Reel®; Tolerance: ±1%; Composition: Thick Film; Features: Moisture Resistant; Operating Temperature: -55°C ~ 155°C; Package / Case: 0805 (2012 Metric); Supplier Device Package: 0805; Size / Dimension: 0.079" L x 0.049" W (2.00mm x 1.25mm); Height: 0.024" (0.60mm); Number of Terminations: 2; ComponentLink1URL: http://www.yageo.com/documents/recent/PYu-RC_Group_51_RoHS_L_04.pdf; ComponentLink1Description: http://www.yageo.com/documents/recent/PYu-RC_Group_51_RoHS_L_04.pdf; Supplier Part Number 1: 311-1.50KCRDKR-ND; Supplier 2: Digi-Key; Stock 2: 28544; Pricing 2: 1=0.1, 10=0.054, 25=0.0392, 50=0.03, 100=0.0221, 250=0.01684, 500=0.01346, 1000=0.00991, 2500=0.0086 (USD); Part Status: Active; Failure Rate: -; ComponentLink2URL: http://www.vishay.com/docs/20035/dcrcwe3.pdf; ComponentLink2Description: http://www.vishay.com/docs/20035/dcrcwe3.pdf; Resistance (Ohms): 1.5k
RI = R-150R,0805: TE CONNECTIVITY / NEOHM - CPF0805B150RE1 - RESISTOR, 0805, 150R; Product Range: TE CONNECTIVITY - CPF Series; Power Rating: 100; Resistance Tolerance: ± 0.1%; Resistor Case Style: 0805 [2012 Metric]; Resistor Element Material: Thin Film; Temperature Coefficient: ± 25; Voltage Rating: 200; External Depth: 0.5; External Length / Height: 2; External Width: 1.25; Resistor Mounting: SMD; Supplier 1: Farnell; Manufacturer: TE CONNECTIVITY / NEOHM; Manufacturer Part Number: CPF0805B150RE1; RoHS: YES; Stock 1: 749; Pricing 1: 10=0,429, 50=0,338, 100=0,324, 500=0,269, 1000=0,235 (EUR); Packaging: Cut Tape; MSL: -; No. of Pins: 2; Operating Temperature Max: 155; Operating Temperature Min: -55; Operating Temperature Range: -55°C to +155; Series: CPF<!--FANDB--><div class="features-and-benefits-container"></div>; ComponentLink1URL: http://www.tycoelectronics.com/commerce/DocumentDelivery/DDEController?Action=srchrtrv&DocNm=1614884&DocType=Customer+Drawing&DocLang=English; ComponentLink1Description: http://www.tycoelectronics.com/commerce/DocumentDelivery/DDEController?Action=srchrtrv&DocNm=1614884&DocType=Customer+Drawing&DocLang=English; ComponentLink2URL: http://www.tycoelectronics.com/commerce/DocumentDelivery/DDEController?Action=srchrtrv&DocNm=1773200&DocType=Data+Sheet&DocLang=English; ComponentLink2Description: http://www.tycoelectronics.com/commerce/DocumentDelivery/DDEController?Action=srchrtrv&DocNm=1773200&DocType=Data+Sheet&DocLang=English; Supplier Part Number 1: 1697421RL; Resistance: 150 Ohms
RREF = R-3.92K,%1,0805: RES SMD 3.92KOHM 0.1% 1/10W 0805; Manufacturer: TE Connectivity AMP Connectors; Power (Watts): 0.1W, 1/10W; Temperature Coefficient: ±10ppm/°C; Supplier 1: Digi-Key; Manufacturer Part Number: RN73C2A3K92BTD; RoHS: RoHS Compliant; Category: Resistors; Stock 1: 8776; Pricing 1: 1=0.74, 10=0.621, 25=0.532, 50=0.4788, 100=0.4168, 250=0.37248, 500=0.30152, 1000=0.24388, 2500=0.2359 (USD); Packaging: Cut Tape (CT); Part Status: Active; Tolerance: ±0.1%; Composition: Thin Film; Features: -; Operating Temperature: -55°C ~ 155°C; Package / Case: 0805 (2012 Metric); Supplier Device Package: 0805; Size / Dimension: 0.079" L x 0.049" W (2.00mm x 1.25mm); Height: 0.026" (0.65mm); Number of Terminations: 2; ComponentLink1URL: http://media.digikey.com/pdf/Data%20Sheets/Tyco%20Electonics%20AMP%20PDFs/RN73_Series_2011.pdf; ComponentLink1Description: http://media.digikey.com/pdf/Data%20Sheets/Tyco%20Electonics%20AMP%20PDFs/RN73_Series_2011.pdf; Supplier Part Number 1: A119990CT-ND
TP1-TP14 = Testpoint_SMD1mmCircle: Testpoint SMD; PartName: TestpointSMD1mmCircle; TIIntPartnumber: 2H0046; DescriptiveText: Testpoint SMD 1mm circle pad; Cost100: 0; Mfr: N/A; MfrNum: N/A; Vendor: N/A; Cost10K: 0; Descriptive_Text: Testpoint SMD 1mm circle pad
U1 = PS2801C-4-F3-A: NEC - PS2801C-4-F3-A - OPTOCOUPLER, 4X TR O/P, SSOP-16; Supplier 1: Farnell; Supplier Part Number 1: 1682862
U2 = IC-AD780ARZ: IC VREF SERIES/SHUNT PROG 8SOIC; Manufacturer: Analog Devices Inc.; Reference Type: Series, Shunt; Output Type: Programmable; Voltage - Output (Min/Fixed): ±2.5V, ±3V; Current - Output: 10mA; Tolerance: ±0.2%, ±0.17%; Temperature Coefficient: 7ppm/°C; Noise - 0.1Hz to 10Hz: 4µVp-p; Voltage - Input: 4 V ~ 36 V; Current - Supply: 1mA; Supplier 1: Digi-Key; RoHS: RoHS Compliant; Category: Integrated Circuits (ICs); Stock 1: 1014; Pricing 1: 1=10.53, 10=9.545, 100=7.8685, 500=6.8796 (USD); Packaging: Cut Tape (CT); Voltage - Output (Max): -; Noise - 10Hz to 10kHz: -; Current - Cathode: 1mA; Operating Temperature: -40°C ~ 85°C (TA); Mounting Type: Surface Mount; Package / Case: 8-SOIC (0.154", 3.90mm Width); Supplier Device Package: 8-SOIC; ComponentLink1URL: http://www.analog.com/media/en/technical-documentation/data-sheets/AD780.pdf; ComponentLink1Description: http://www.analog.com/media/en/technical-documentation/data-sheets/AD780.pdf; Supplier Part Number 1: AD780ARZ-REEL7CT-ND
U3 = IC-AD7124-4BCPZ: IC ADC 24BIT 4CH TSSOP; Manufacturer: Analog Devices Inc.; Number of Bits: 24; Sampling Rate (Per Second): 19.2k; Number of Inputs: 4, 7; Input Type: Differential, Single Ended; Data Interface: SPI; Configuration: MUX-PGA-ADC; Number of A/D Converters: 1; Architecture: Sigma-Delta; Reference Type: External, Internal; Voltage - Supply, Analog: ±1.8V, 2.7 V ~ 3.6 V; Voltage - Supply, Digital: 1.65 V ~ 3.6 V; Supplier 1: Digi-Key; RoHS: RoHS Compliant; Category: Integrated Circuits (ICs); Stock 1: 46; Pricing 1: 1=10.3, 10=9.307, 100=7.7056, 500=6.70996, 1000=5.84415, 2500=5.6277, 5000=5.41125 (USD); Packaging: Tray; Part Status: Active; Ratio - S/H:ADC: -; Features: PGA, Temperature Sensor; Operating Temperature: -40°C ~ 105°C; Package / Case: 32-WFQFN Exposed Pad, CSP; Supplier Device Package: 32-LFCSP-WQ (5x5); ComponentLink1URL: http://www.analog.com/media/en/technical-documentation/data-sheets/AD7124-4.pdf; ComponentLink1Description: http://www.analog.com/media/en/technical-documentation/data-sheets/AD7124-4.pdf; Supplier 2: Digi-Key; Stock 2: 146; Pricing 2: 1=10.3, 62=8.87452, 124=7.70565, 558=6.70995, 1054=5.84415, 2542=5.6277, 5000=5.41125 (USD); Supplier Part Number 2: AD7124-4BRUZ-ND; Manufacturer Part Number: AD7124-4BCPZ
U4 = IC-ADUM5401: DGTL ISO 2.5KV GEN PURP 16SOIC; Manufacturer: Analog Devices Inc.; Isolated Power: Yes; Number of Channels: 4; Inputs - Side 1/Side 2: 3/1; Channel Type: Unidirectional; Voltage - Isolation: 2500Vrms; Common Mode Transient Immunity (Min): 25kV/µs; Data Rate: 1Mbps; Propagation Delay tpLH / tpHL (Max): 100ns, 100ns; Pulse Width Distortion (Max): 40ns; Rise / Fall Time (Typ): 2.5ns, 2.5ns; Voltage - Supply: 3 V ~ 5.5 V; Supplier 1: Digi-Key; Manufacturer Part Number: ADUM5401ARWZ-RL; RoHS: RoHS Compliant; Category: Isolators; Stock 1: 2137; Pricing 1: 1=10.71, 10=9.818, 100=8.2883, 500=7.35092 (USD); Packaging: Cut Tape (CT); Part Status: Active; Technology: Magnetic Coupling; Type: General Purpose; Operating Temperature: -40°C ~ 105°C; Package / Case: 16-SOIC (0.295", 7.50mm Width); Supplier Device Package: 16-SOIC; ComponentLink1URL: http://www.analog.com/media/en/technical-documentation/data-sheets/ADuM5401_5402_5403_5404.pdf; ComponentLink1Description: http://www.analog.com/media/en/technical-documentation/data-sheets/ADuM5401_5402_5403_5404.pdf; Supplier Part Number 1: ADUM5401ARWZ-RLCT-ND
U5 = IC-DG333ADW-E3: IC SWITCH QUAD SPDT 20SOIC; Manufacturer: Vishay Siliconix; Multiplexer/Demultiplexer Circuit: 2:1; Number of Circuits: 1; On-State Resistance (Max): 45 Ohm; Channel-to-Channel Matching (&Delta;Ron): 2 Ohm (Max); Voltage - Supply, Single (V+): 5 V ~ 40 V; Voltage - Supply, Dual (V±): ±4 V ~ 22 V; Switch Time (Ton, Toff) (Max): 175ns, 145ns; Charge Injection: 10pC; Channel Capacitance (CS(off), CD(off)): 8pF; Current - Leakage (IS(off)) (Max): 250pA; Crosstalk: -80dB @ 1MHz; Supplier 1: Digi-Key; RoHS: RoHS Compliant; Category: Integrated Circuits (ICs); Stock 1: 509; Pricing 1: 1=4.77, 10=4.284, 25=4.05, 100=3.51, 250=3.33, 500=2.988, 1000=2.52, 2500=2.394, 5000=2.304 (USD); Packaging: Tube; Part Status: Active; Switch Circuit: SPDT; -3db Bandwidth: -; Operating Temperature: -40°C ~ 85°C (TA); Package / Case: 20-SOIC (0.295", 7.50mm Width); Supplier Device Package: 20-SOIC; ComponentLink1URL: http://www.vishay.com/docs/70803/dg333a.pdf; ComponentLink1Description: http://www.vishay.com/docs/70803/dg333a.pdf; Supplier Part Number 1: DG333ADW-E3-ND
U6 U8-U10 = IC-AQY282SX: RELAY OPTO AC/DC 60V 500MA 4-SOP; Manufacturer: Panasonic Electric Works; Circuit: SPST-NO (1 Form A); Output Type: AC, DC; On-State Resistance (Max): 2.5 Ohm; Voltage - Input: 1.14VDC; Voltage - Load: 0 ~ 60 V; Supplier 1: Digi-Key; RoHS: RoHS Compliant; Category: Relays; Stock 1: 28000; Pricing 1: 1000=0.924, 3000=0.9075, 5000=0.891, 10000=0.8778 (USD); Packaging: Tape & Reel (TR); Part Status: Active; Load Current: 500mA; Mounting Type: Surface Mount; Termination Style: Gull Wing; Package / Case: 4-SOP (0.173", 4.40mm); Supplier Device Package: 4-SOP; Relay Type: Relay; ComponentLink1URL: http://media.digikey.com/pdf/Data%20Sheets/Panasonic%20Electric%20Works%20PDFs/AQW,AQY280,282,284.pdf; ComponentLink1Description: http://media.digikey.com/pdf/Data%20Sheets/Panasonic%20Electric%20Works%20PDFs/AQW,AQY280,282,284.pdf; Supplier Part Number 1: 255-3393-2-ND; Manufacturer Part Number: AQY282SX
U7 = IC-TLV316IDBVT: IC OP AMP CMOS RR 10MHZ SOT-23; Manufacturer: Texas Instruments (TI); Supplier 1: Digikey; Stock: 1004; Pricing 1: 1=0.91, 10=0.799, 100=0.611 (USD); Supplier Part Number 1: 296-43939-1-ND; Manufacturer Part Number: TLV316IDBVT

## Sheet [02] - STM32F1.SchDoc
size A3; DocumentNumber: 4; SheetNumber: 4; SheetTotal: 5
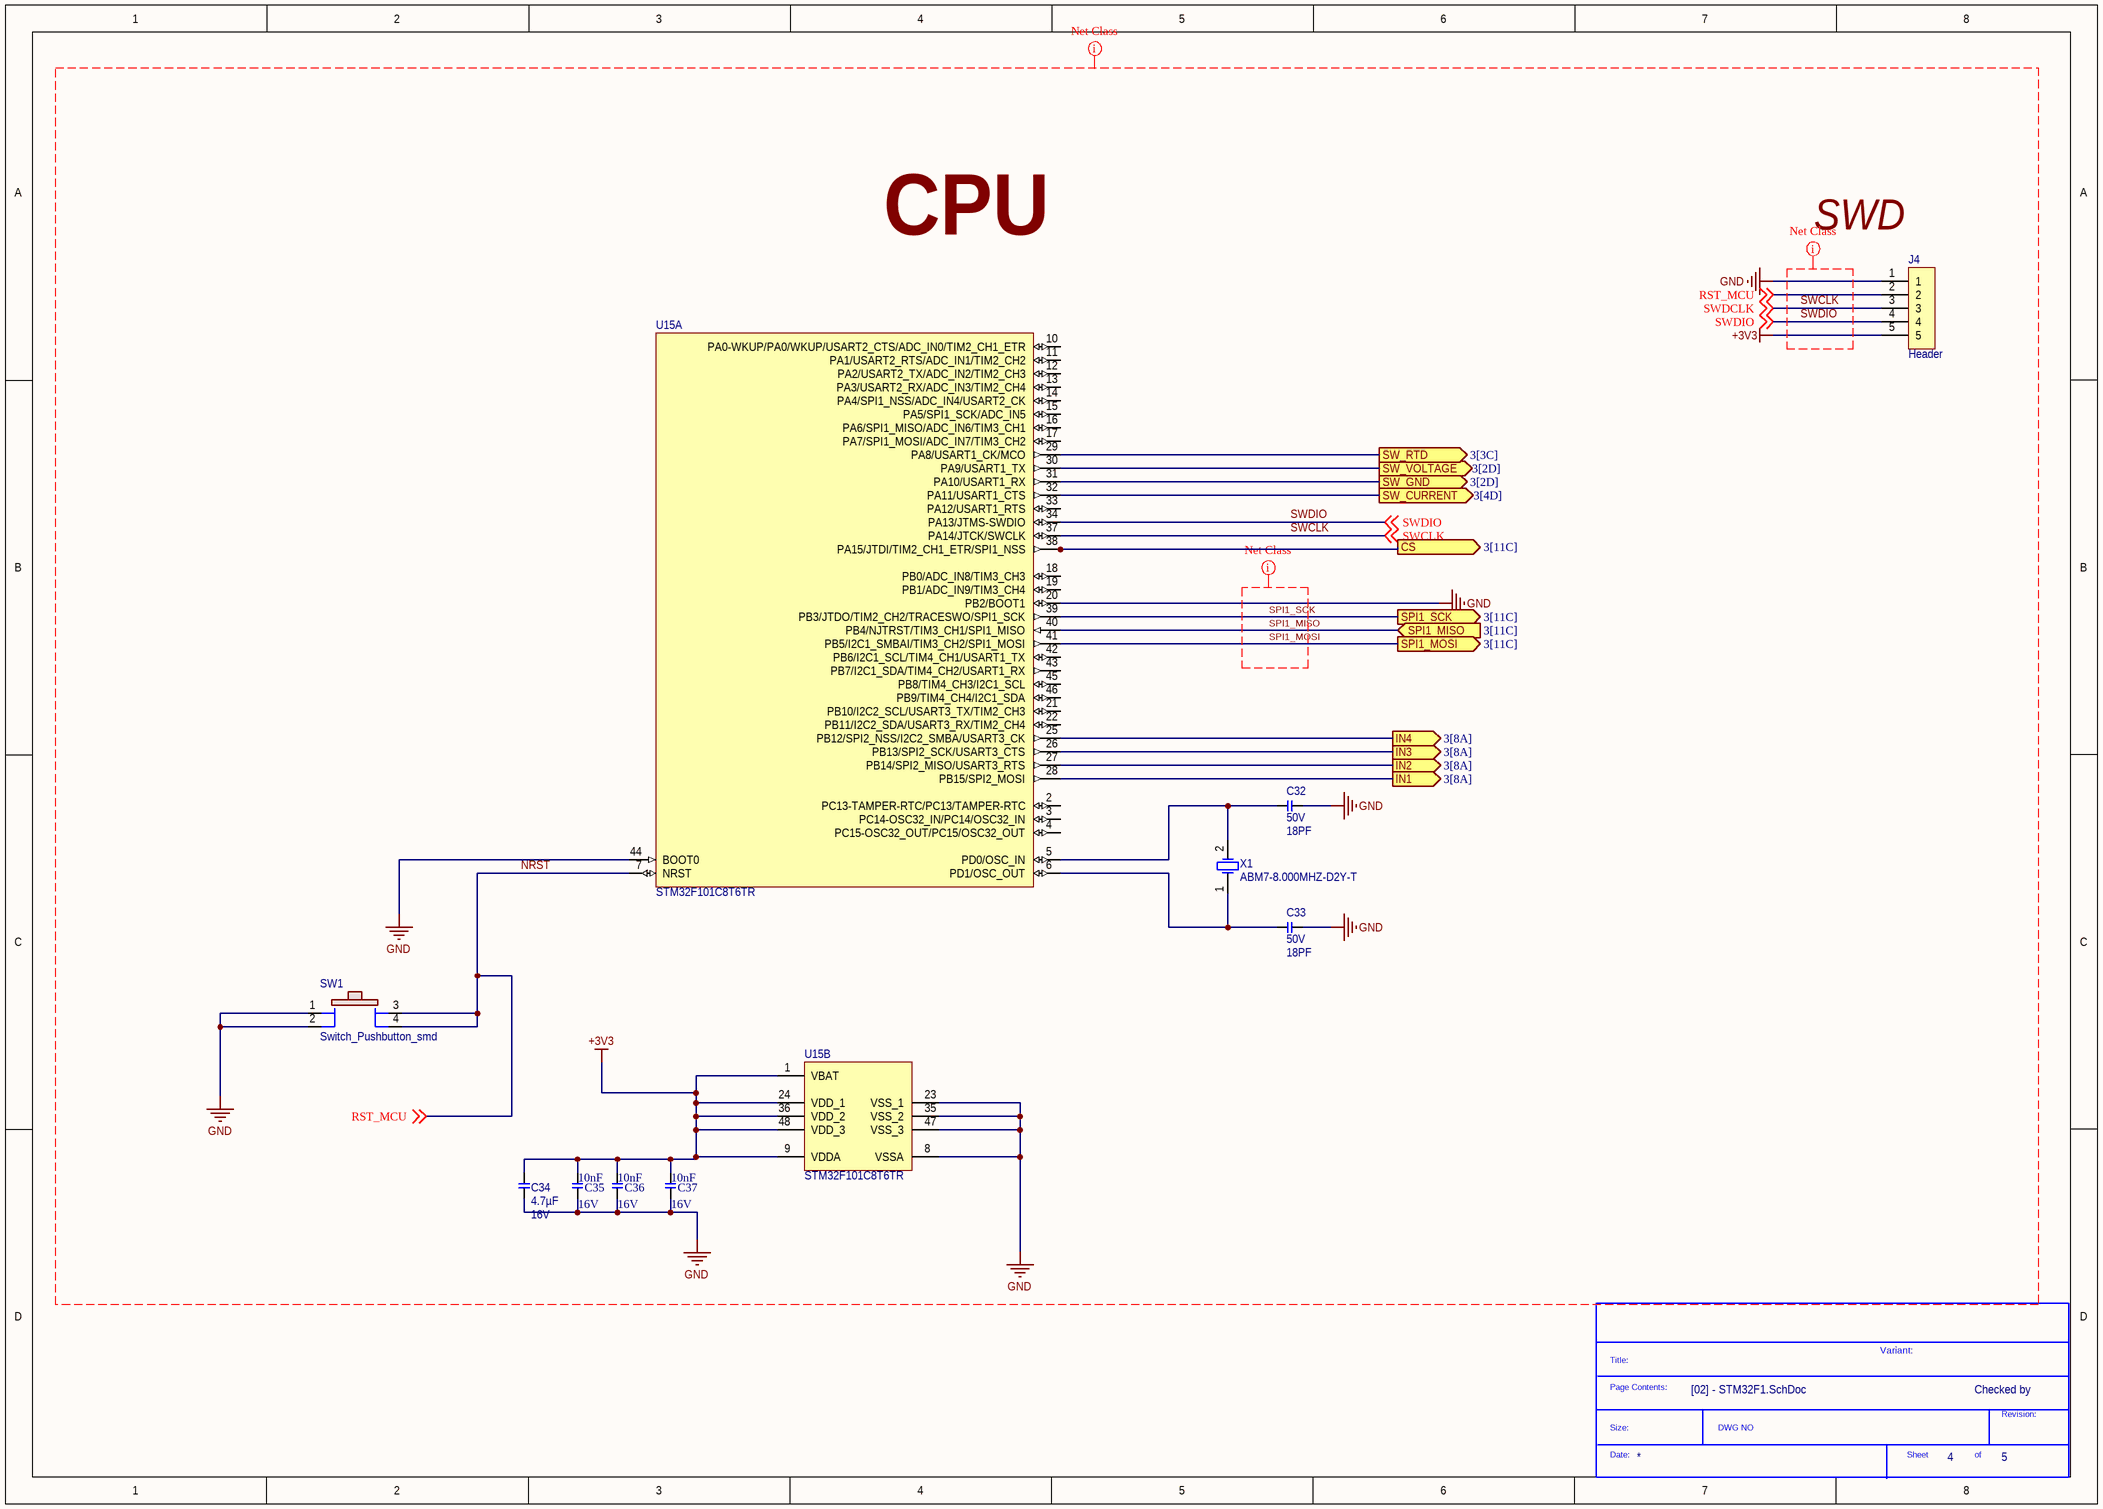
[diagram p5: [02] - STM32F1.SchDoc]

### Parts
(Parts that share a designator on the sheet are numbered #1, #2 ... from top to bottom, then left to right.)
*?#2  SDTitleBlock  (value not drawn)  (graphical)
C32  voltage_rating_dc: 50V  [C0805]  (hidden comment: 18PF)
C33  voltage_rating_dc: 50V  [C0805]  (hidden comment: 18PF)
C34  Voltage - Rated: 16V  [C0805]  (hidden comment: 4.7µF)
C35  Voltage - Rated: 16V  [C0805]  (hidden comment: 10nF)
C36  Voltage - Rated: 16V  [C0805]  (hidden comment: 10nF)
C37  Voltage - Rated: 16V  [C0805]  (hidden comment: 10nF)
J4  Header  [Header 1x5 2.54mm]  (no BOM)
SW1  Switch_Pushbutton_smd  [SW_B3SL-1022P]
U15  Manufacturer Part Number: STM32F101C8T6TR  [STM-LQFP48_M]  (hidden comment: IC-MC-STM32F101C8T6TR)  (parts A,B of 2)
X1  Manufacturer Part Number: ABM7-8.000MHZ-D2Y-T  [sm_osc_mixed]  (hidden comment: ABM7-8.000MHZ)

### Ports
CS (out, see 3[11C]), IN1 (out, see 3[8A]), IN2 (out, see 3[8A]), IN3 (out, see 3[8A]), IN4 (out, see 3[8A]), SPI1_MISO (in, see 3[11C]), SPI1_MOSI (out, see 3[11C]), SPI1_SCK (out, see 3[11C]), SW_CURRENT (out, see 3[4D]), SW_GND (out, see 3[2D]), SW_RTD (out, see 3[3C]), SW_VOLTAGE (out, see 3[2D])

### Nets
+3V3: C34.2 C35.2 C36.2 C37.2 J4.5 U15.1(VBAT) U15.9(VDDA) U15.24(VDD_1) U15.36(VDD_2) U15.48(VDD_3)
GND: C32.2 C33.2 C34.1 C35.1 C36.1 C37.1 J4.1 SW1.1 SW1.2 U15.8(VSSA) U15.20(PB2/BOOT1) U15.23(VSS_1) U15.35(VSS_2) U15.44(BOOT0) U15.47(VSS_3)
NRST: J4.2 SW1.3 SW1.4 U15.7(NRST) ; off-sheet RST_MCU  [also labelled RST_MCU]
SPI1_MISO: U15.40(PB4/NJTRST/TIM3_CH1/SPI1_MISO) ; port SPI1_MISO
SPI1_MOSI: U15.41(PB5/I2C1_SMBAI/TIM3_CH2/SPI1_MOSI) ; port SPI1_MOSI
SPI1_SCK: U15.39(PB3/JTDO/TIM2_CH2/TRACESWO/SPI1_SCK) ; port SPI1_SCK
SWCLK: J4.3 U15.37(PA14/JTCK/SWCLK) ; off-sheet SWCLK, off-sheet SWDCLK  [also labelled SWDCLK]
SWDIO: J4.4 U15.34(PA13/JTMS-SWDIO) ; off-sheet SWDIO
NetC32_1: C32.1 U15.5(PD0/OSC_IN) X1.2(OSC2)
NetC33_1: C33.1 U15.6(PD1/OSC_OUT) X1.1(OSC1)
NetR1_2: U15.28(PB15/SPI2_MOSI) ; port IN1
NetR2_2: U15.27(PB14/SPI2_MISO/USART3_RTS) ; port IN2
NetR3_2: U15.26(PB13/SPI2_SCK/USART3_CTS) ; port IN3
NetR4_2: U15.25(PB12/SPI2_NSS/I2C2_SMBA/USART3_CK) ; port IN4
NetR16_1: U15.29(PA8/USART1_CK/MCO) ; port SW_RTD
NetR27_1: U15.32(PA11/USART1_CTS) ; port SW_CURRENT
NetR28_1: U15.30(PA9/USART1_TX) ; port SW_VOLTAGE
NetR37_1: U15.31(PA10/USART1_RX) ; port SW_GND
NetU4_3: U15.38(PA15/JTDI/TIM2_CH1_ETR/SPI1_NSS) ; port CS

Not connected (* = marked no-connect by the designer): U15 2(PC13-TAMPER-RTC/PC13/TAMPER-RTC) 3(PC14-OSC32_IN/PC14/OSC32_IN) 4(PC15-OSC32_OUT/PC15/OSC32_OUT) 10(PA0-WKUP/PA0/WKUP/USART2_CTS/ADC_IN0/TIM2_CH1_ETR) 11(PA1/USART2_RTS/ADC_IN1/TIM2_CH2) 12(PA2/USART2_TX/ADC_IN2/TIM2_CH3) 13(PA3/USART2_RX/ADC_IN3/TIM2_CH4) 14(PA4/SPI1_NSS/ADC_IN4/USART2_CK) 15(PA5/SPI1_SCK/ADC_IN5) 16(PA6/SPI1_MISO/ADC_IN6/TIM3_CH1) 17(PA7/SPI1_MOSI/ADC_IN7/TIM3_CH2) 18(PB0/ADC_IN8/TIM3_CH3) 19(PB1/ADC_IN9/TIM3_CH4) 21(PB10/I2C2_SCL/USART3_TX/TIM2_CH3) 22(PB11/I2C2_SDA/USART3_RX/TIM2_CH4) 33(PA12/USART1_RTS) 42(PB6/I2C1_SCL/TIM4_CH1/USART1_TX) 43(PB7/I2C1_SDA/TIM4_CH2/USART1_RX) 45(PB8/TIM4_CH3/I2C1_SCL) 46(PB9/TIM4_CH4/I2C1_SDA)

### Layout directives
net class SPI_1: SPI1_MISO, SPI1_MOSI, SPI1_SCK
net class SWD: SWCLK, SWDIO
net class CPU: +3V3, GND, NRST, RST_MCU, SPI1_MISO, SPI1_MOSI, SPI1_SCK, SWCLK, SWDCLK, SWDIO

### Notes on the sheet
- (near J4) SWD
- CPU
- Variant:
- Checked by
- (in symbol SDTitleBlock) Title:; Page Contents:; Revision:; Size:; DWG NO; Date:; Sheet; of

### Library data of the parts
C32 C33 = C-18PF,50V,0805: MULTICOMP - MC0805N180J500CT - CAP, MLCC, C0G/NP0, 18PF, 50V,0805, REEL; capacitance_tolerance: ±5%; pin_count: 2; Supplier 1: Octopart; Manufacturer: Multicomp; Manufacturer Part Number: MC0805N180J500CT; Stock 1: 3187; Pricing 1: 1=0.11400, 10=0.07300, 50=0.04100, 100=0.03200, 250=0.02600, 500=0.02200, 1000=0.01800 (USD); reach_svhc_compliance: No SVHC; rohs_status: Compliant; dielectric_characteristic: C0G/NP0; Octopart Url: http://octopart.com/mc0805n180j500ct-multicomp-10529169; Seller Landing  Url: https://octopart-clicks.com/click/track?country=TR&ak=8157f166&sig=03c9fd1&sid=2402&ppid=10529169&vpid=17760821&ct=offers; OctopartID: 811748bd0de05ed0; ComponentLink1URL: http://datasheet.octopart.com/MC0805N180J500CT-Multicomp-datasheet-16478625.pdf; ComponentLink1Description: http://datasheet.octopart.com/MC0805N180J500CT-Multicomp-datasheet-16478625.pdf; ComponentLink2URL: http://datasheet.octopart.com/MC0805N180J500CT-Multicomp-datasheet-22150886.pdf; ComponentLink2Description: http://datasheet.octopart.com/MC0805N180J500CT-Multicomp-datasheet-22150886.pdf; ComponentLink3URL: http://datasheet.octopart.com/MC0805N180J500CT-Multicomp-datasheet-8445804.pdf; ComponentLink3Description: http://datasheet.octopart.com/MC0805N180J500CT-Multicomp-datasheet-8445804.pdf; ComponentLink4URL: http://datasheet.octopart.com/MC0805N180J500CT-Multicomp-datasheet-34215986.pdf; ComponentLink4Description: http://datasheet.octopart.com/MC0805N180J500CT-Multicomp-datasheet-34215986.pdf; ComponentLink5URL: http://datasheet.octopart.com/MC0805N180J500CT-Multicomp-datasheet-26590290.pdf; ComponentLink5Description: http://datasheet.octopart.com/MC0805N180J500CT-Multicomp-datasheet-26590290.pdf; ComponentLink6URL: http://datasheet.octopart.com/MC0805N180J500CT-Multicomp-datasheet-15500401.pdf; ComponentLink6Description: http://datasheet.octopart.com/MC0805N180J500CT-Multicomp-datasheet-15500401.pdf; ComponentLink7URL: http://datasheet.octopart.com/MC0805N180J500CT-Multicomp-datasheet-10838970.pdf; ComponentLink7Description: http://datasheet.octopart.com/MC0805N180J500CT-Multicomp-datasheet-10838970.pdf; Supplier Part Number 1: Newark - 06R4039; capacitance: 18PF
C34 = C-4.7UF,16V,0805: AVX - 0805YC475KAT2A - CAP, MLCC, X7R, 4.7UF, 16V, 0805; Manufacturer: AVX Corporation; Tolerance: ±10%; Supplier 1: Digi-Key; Manufacturer Part Number: 0805YC475KAT2A; RoHS: RoHS Compliant; Category: Capacitors; Stock 1: 16611; Pricing 1: 1=0.78, 10=0.578, 25=0.4952, 50=0.462, 100=0.396, 250=0.363, 500=0.3135, 1000=0.264 (USD); Packaging: Cut Tape (CT); Temperature Coefficient: X7R; Mounting Type: Surface Mount, MLCC; Operating Temperature: -55°C ~ 125°C; Applications: General Purpose; Ratings: -; Package / Case: 0805 (2012 Metric); Size / Dimension: 0.079" L x 0.049" W (2.01mm x 1.25mm); Height - Seated (Max): -; Thickness (Max): 0.060" (1.52mm); Lead Spacing: -; Features: -; Lead Style: -; ComponentLink1URL: http://datasheets.avx.com/X7RDielectric.pdf; ComponentLink1Description: http://datasheets.avx.com/X7RDielectric.pdf; Supplier Part Number 1: 478-5722-1-ND; Capacitance: 4.7µF
C35-C37 = C-10NF,0805: as C1 on sheet [01] - AFE; Supplier 1: Digi-Key; RoHS: RoHS Compliant; Category: Capacitors; Stock 1: 28062; Pricing 1: 1=0.29, 10=0.204, 25=0.1668, 50=0.1424, 100=0.1221, 250=0.10176, 500=0.09158, 1000=0.07733 (USD); Packaging: Cut Tape (CT); Mounting Type: Surface Mount, MLCC; Operating Temperature: -55°C ~ 125°C; Applications: General Purpose; Ratings: -; Package / Case: 0805 (2012 Metric); Size / Dimension: 0.079" L x 0.049" W (2.01mm x 1.25mm); Height - Seated (Max): -; Thickness (Max): 0.037" (0.94mm); Lead Spacing: -; Features: -; Lead Style: -; ComponentLink1URL: http://datasheets.avx.com/C0GNP0-Dielectric.pdf; ComponentLink1Description: http://datasheets.avx.com/C0GNP0-Dielectric.pdf; Supplier Part Number 1: 478-1334-1-ND; Capacitance: 10nF
J4 = CON-Header 1X5 2.54MM: Header 1X5 2.54
SW1 = Switch_Pushbutton_smd: Switch Push Button tactile; TIIntPartnumber: 2W0018; MfrNum: B3SL-1022P; Mfr: Omron; PartName: SwitchPushMomTactilesmd; Cost10K: 0.25; Cost100: 0.340; Vendor: Digikey; DescriptiveText: Switch Push Button tactile; Descriptive_Text: Switch Push Button tactile
U15 = IC-MC-STM32F101C8T6TR: IC MCU 32BIT 64KB FLASH 48LQFP; Manufacturer: STMicroelectronics; Core Processor: ARM® Cortex®-M3; Core Size: 32-Bit; Speed: 36MHz; Connectivity: I²C, IrDA, LIN, SPI, UART/USART; Peripherals: DMA, PDR, POR, PVD, PWM, Temp Sensor, WDT; Number of I/O: 37; Program Memory Size: 64KB (64K x 8); RAM Size: 10K x 8; Voltage - Supply (Vcc/Vdd): 2 V ~ 3.6 V; Data Converters: A/D 10x12b; Oscillator Type: Internal; Supplier 1: Digi-Key; RoHS: RoHS Compliant; Category: Integrated Circuits (ICs); Stock 1: 0; Pricing 1: 2400=2.46449 (USD); Packaging: Tape & Reel (TR); Program Memory Type: FLASH; EEPROM Size: -; Operating Temperature: -40°C ~ 85°C (TA); Package / Case: 48-LQFP; Supplier Device Package: 48-LQFP (7x7); ComponentLink1URL: http://www.st.com/content/ccc/resource/technical/document/datasheet/6b/28/4e/ce/a7/d3/42/8d/CD00161561.pdf/files/CD00161561.pdf/jcr:content/translations/en.CD00161561.pdf; ComponentLink1Description: http://www.st.com/content/ccc/resource/technical/document/datasheet/6b/28/4e/ce/a7/d3/42/8d/CD00161561.pdf/files/CD00161561.pdf/jcr:content/translations/en.CD00161561.pdf; Supplier Part Number 1: STM32F101C8T6TR-ND
X1 = OSC-ABM7-8.000MHZ-D2Y-T: CRYSTAL 8.0000MHZ 18PF SMD; Manufacturer: Abracon LLC; Frequency: 8MHz; Frequency Stability: ±30ppm; Frequency Tolerance: ±20ppm; ESR (Equivalent Series Resistance): 100 Ohm; Operating Mode: Fundamental; Supplier 1: Digi-Key; RoHS: RoHS Compliant; Category: Crystals and Oscillators; Stock 1: 111842; Pricing 1: 1=0.76, 10=0.678, 50=0.6328, 100=0.56, 500=0.5292 (USD); Packaging: Cut Tape (CT); Type: MHz Crystal; Load Capacitance: 18pF; Operating Temperature: -40°C ~ 85°C; Ratings: -; Mounting Type: Surface Mount; Package / Case: 2-SMD, No Lead (DFN, LCC); Size / Dimension: 0.236" L x 0.138" W (6.00mm x 3.50mm); Height: 0.055" (1.40mm); ComponentLink1URL: http://www.abracon.com/Resonators/abm7.pdf; ComponentLink1Description: http://www.abracon.com/Resonators/abm7.pdf; Supplier Part Number 1: 535-9831-1-ND